# EAGLE schematic 2x16MUX_1 (EAGLE 6.5.0)

## Sheet 1 of 10
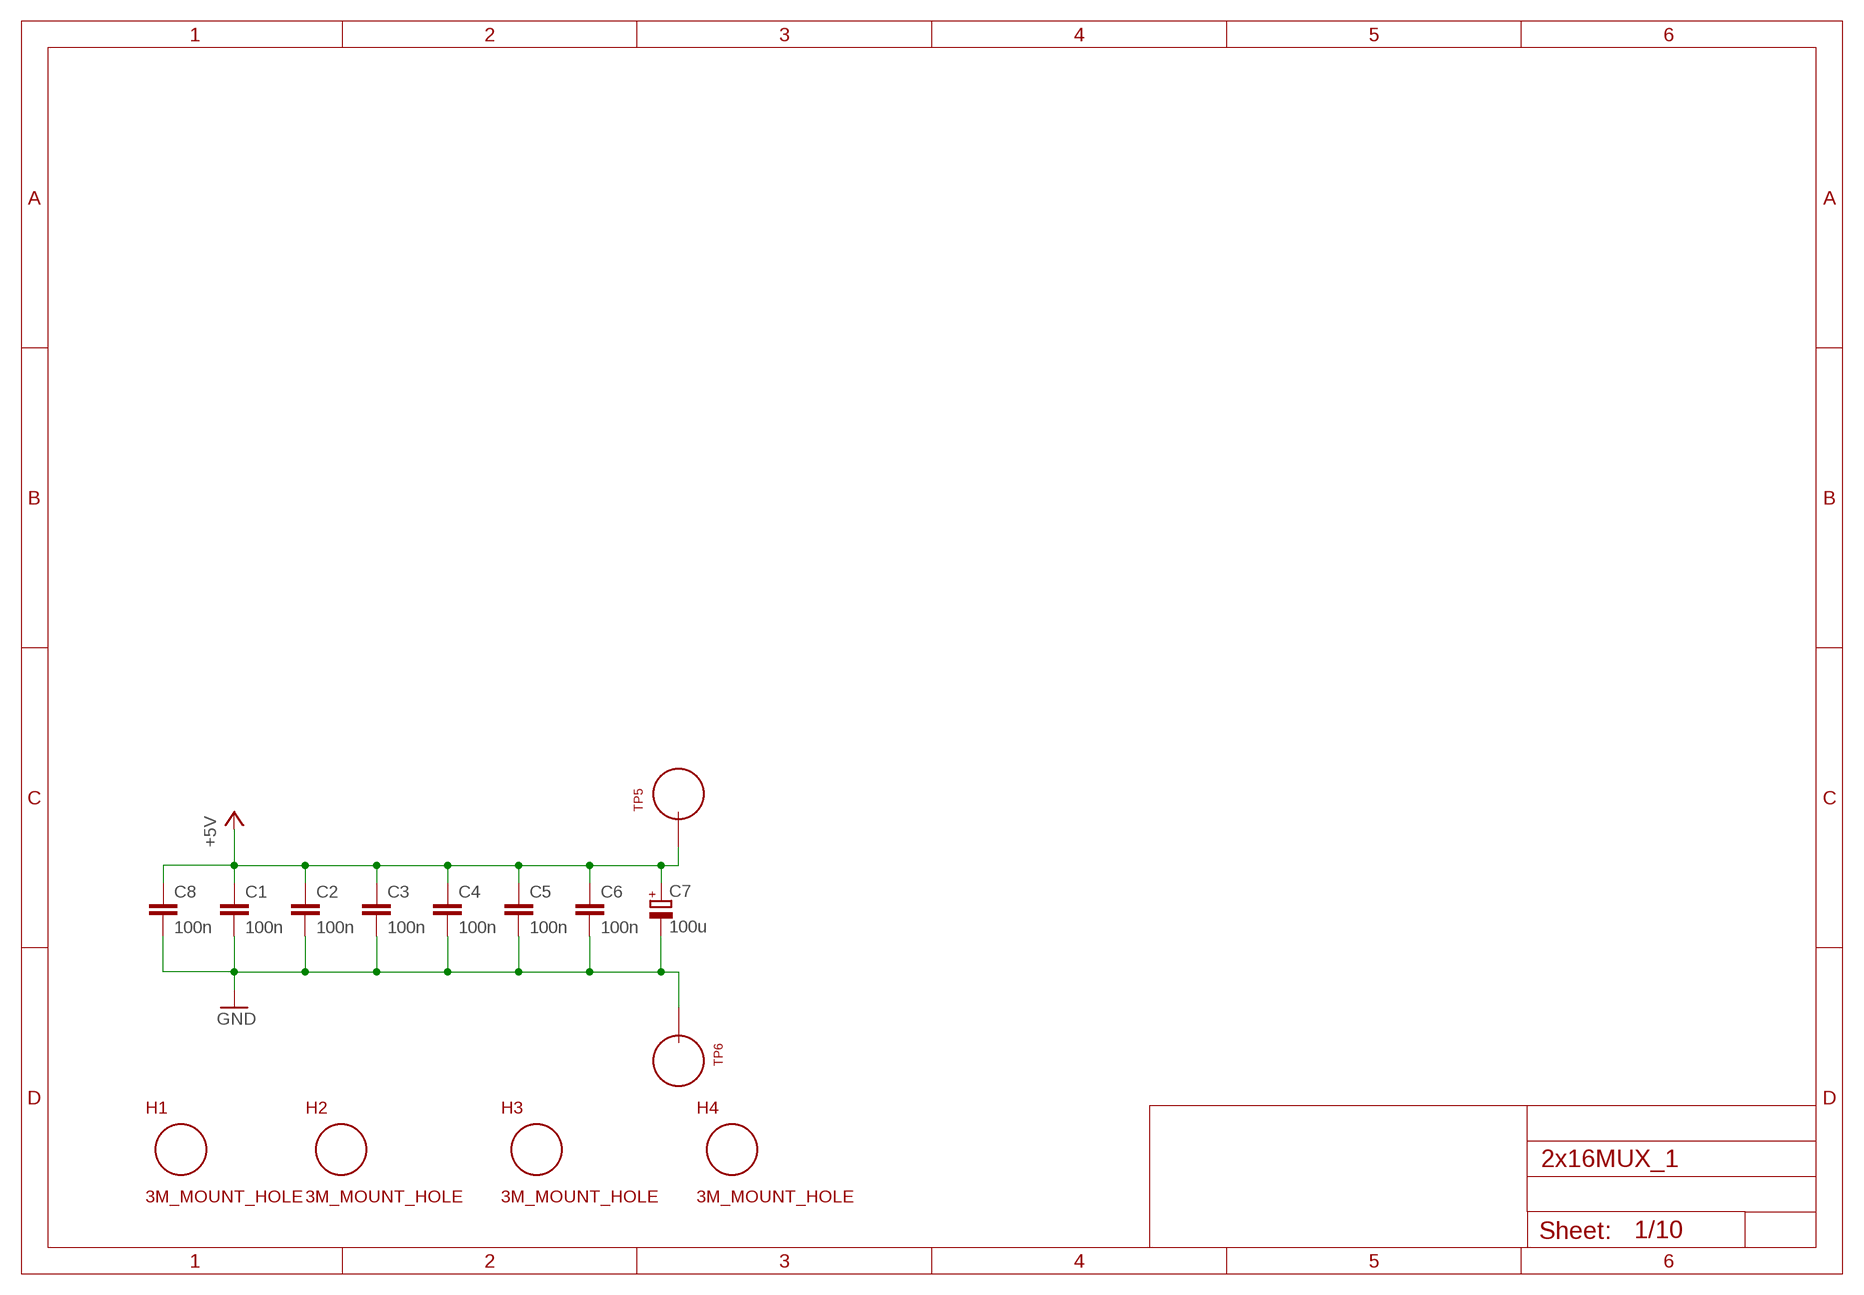
[diagram p0: schematic, sheet 1]

### Parts
C1  100n  C_P2INCH  [CAP_P2INCH]
C2  100n  C_P2INCH  [CAP_P2INCH]
C3  100n  C_P2INCH  [CAP_P2INCH]
C4  100n  C_P2INCH  [CAP_P2INCH]
C5  100n  C_P2INCH  [CAP_P2INCH]
C6  100n  C_P2INCH  [CAP_P2INCH]
C7  100u  POLARISED_CAP_2P5_6P3MM  [POLARISED_CAP_2P5_6P3MM]
C8  100n  C_P2INCH  [CAP_P2INCH]
H1  3M_MOUNT_HOLE  [3M_HOLE]
H2  3M_MOUNT_HOLE  [3M_HOLE]
H3  3M_MOUNT_HOLE  [3M_HOLE]
H4  3M_MOUNT_HOLE  [3M_HOLE]
TP5  TEST_LOOP  [TEST_LOOP]
TP6  TEST_LOOP  [TEST_LOOP]

### Nets
+5V: C1.1 C2.1 C3.1 C4.1 C5.1 C6.1 C7.A C8.1 TP5.P$1 ; also sheet 2,3,4,5,6,7,8,9
GND: C1.2 C2.2 C3.2 C4.2 C5.2 C6.2 C7.K C8.2 TP6.P$1 ; also sheet 2,3,4,5,6,7,8,9,10

## Sheet 2 of 10
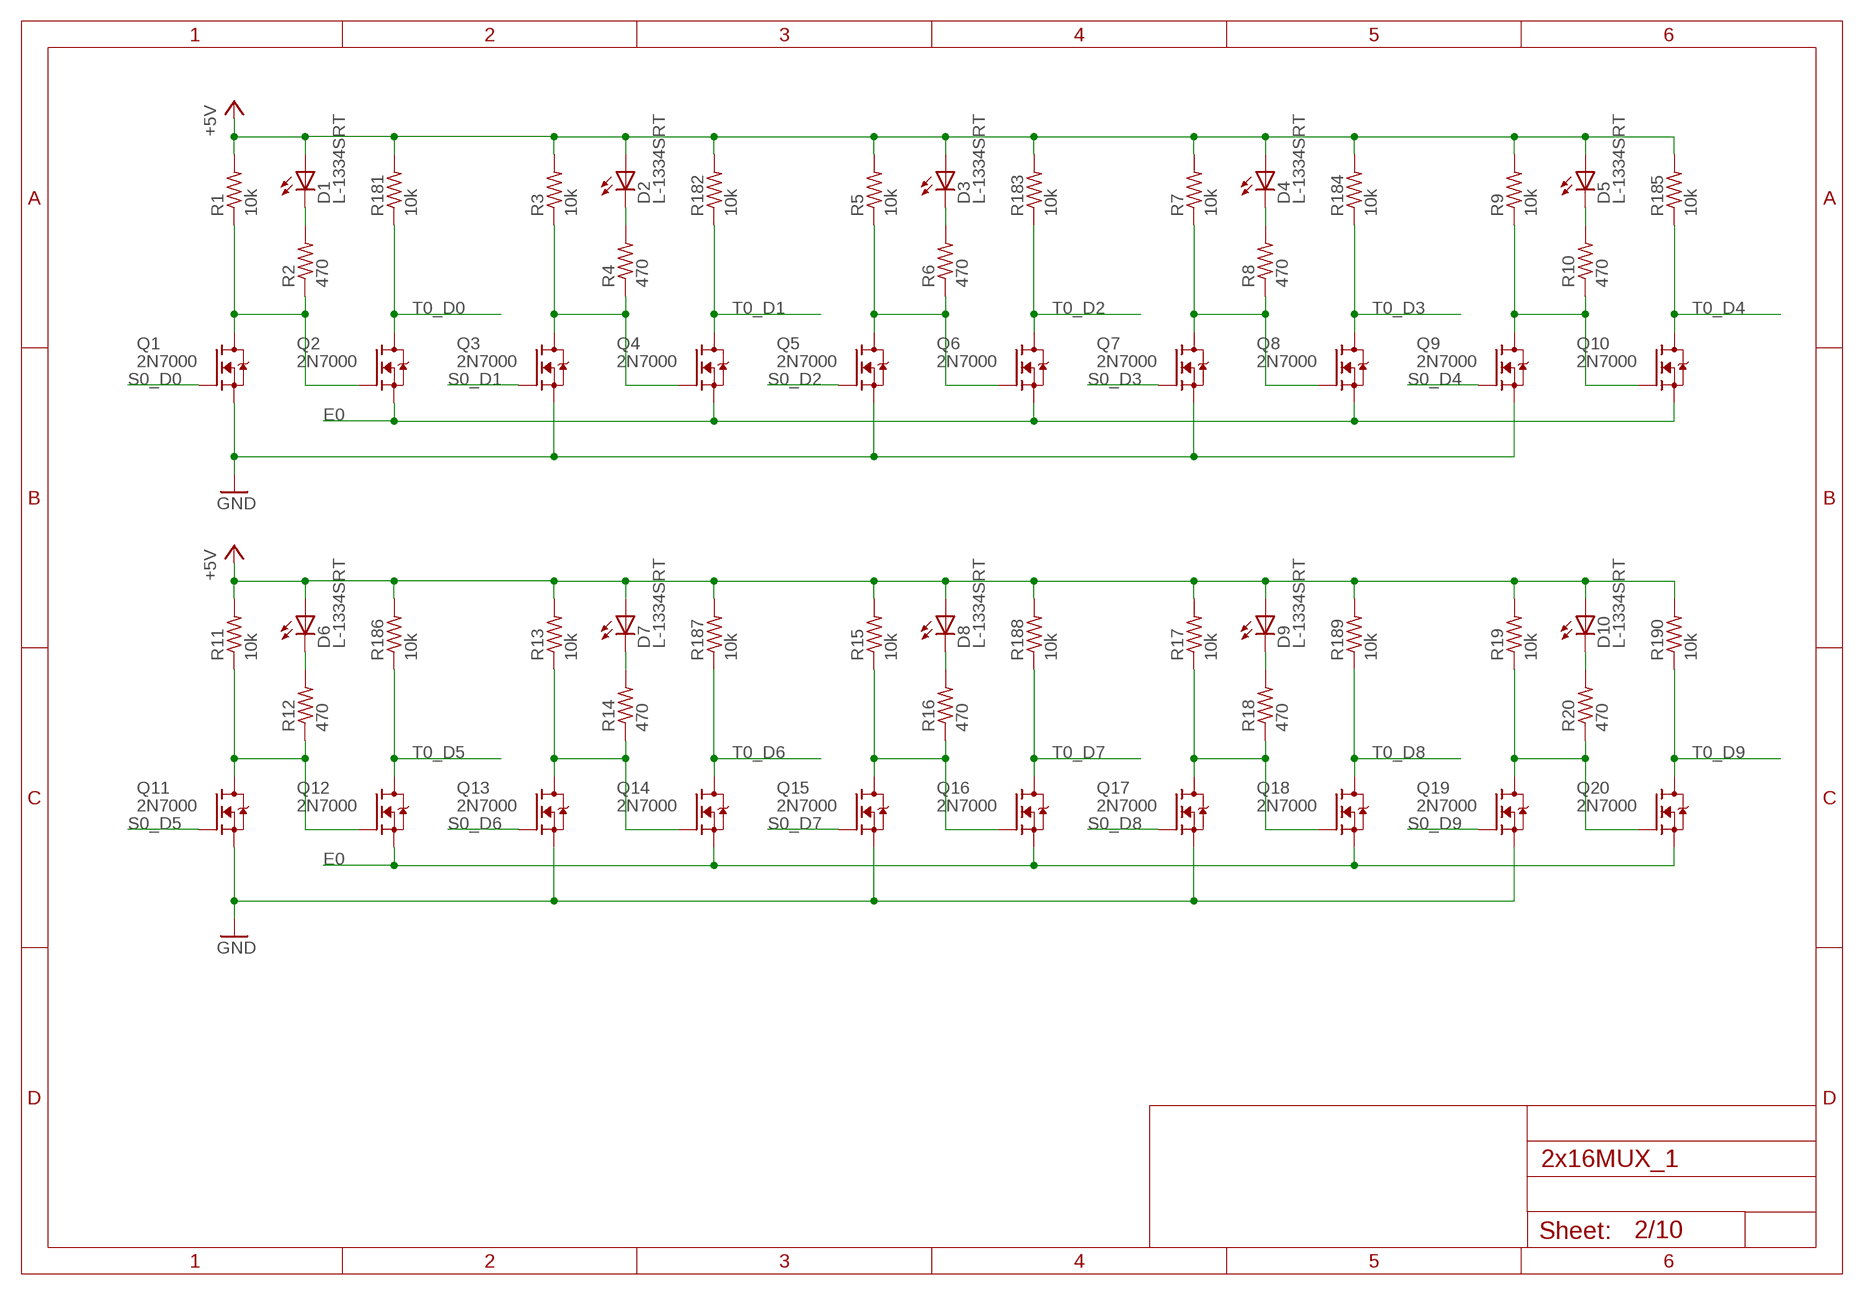
[diagram p1: schematic, sheet 2]

### Parts
D1  L-1334SRT  [LED3MM]
D2  L-1334SRT  [LED3MM]
D3  L-1334SRT  [LED3MM]
D4  L-1334SRT  [LED3MM]
D5  L-1334SRT  [LED3MM]
D6  L-1334SRT  [LED3MM]
D7  L-1334SRT  [LED3MM]
D8  L-1334SRT  [LED3MM]
D9  L-1334SRT  [LED3MM]
D10  L-1334SRT  [LED3MM]
Q1  2N7000  [TO92-DGS]
Q2  2N7000  [TO92-DGS]
Q3  2N7000  [TO92-DGS]
Q4  2N7000  [TO92-DGS]
Q5  2N7000  [TO92-DGS]
Q6  2N7000  [TO92-DGS]
Q7  2N7000  [TO92-DGS]
Q8  2N7000  [TO92-DGS]
Q9  2N7000  [TO92-DGS]
Q10  2N7000  [TO92-DGS]
Q11  2N7000  [TO92-DGS]
Q12  2N7000  [TO92-DGS]
Q13  2N7000  [TO92-DGS]
Q14  2N7000  [TO92-DGS]
Q15  2N7000  [TO92-DGS]
Q16  2N7000  [TO92-DGS]
Q17  2N7000  [TO92-DGS]
Q18  2N7000  [TO92-DGS]
Q19  2N7000  [TO92-DGS]
Q20  2N7000  [TO92-DGS]
R1  10k  R_P2INCH  [R_P2INCH]
R2  470  R_P2INCH  [R_P2INCH]
R3  10k  R_P2INCH  [R_P2INCH]
R4  470  R_P2INCH  [R_P2INCH]
R5  10k  R_P2INCH  [R_P2INCH]
R6  470  R_P2INCH  [R_P2INCH]
R7  10k  R_P2INCH  [R_P2INCH]
R8  470  R_P2INCH  [R_P2INCH]
R9  10k  R_P2INCH  [R_P2INCH]
R10  470  R_P2INCH  [R_P2INCH]
R11  10k  R_P2INCH  [R_P2INCH]
R12  470  R_P2INCH  [R_P2INCH]
R13  10k  R_P2INCH  [R_P2INCH]
R14  470  R_P2INCH  [R_P2INCH]
R15  10k  R_P2INCH  [R_P2INCH]
R16  470  R_P2INCH  [R_P2INCH]
R17  10k  R_P2INCH  [R_P2INCH]
R18  470  R_P2INCH  [R_P2INCH]
R19  10k  R_P2INCH  [R_P2INCH]
R20  470  R_P2INCH  [R_P2INCH]
R181  10k  R_P2INCH  [R_P2INCH]
R182  10k  R_P2INCH  [R_P2INCH]
R183  10k  R_P2INCH  [R_P2INCH]
R184  10k  R_P2INCH  [R_P2INCH]
R185  10k  R_P2INCH  [R_P2INCH]
R186  10k  R_P2INCH  [R_P2INCH]
R187  10k  R_P2INCH  [R_P2INCH]
R188  10k  R_P2INCH  [R_P2INCH]
R189  10k  R_P2INCH  [R_P2INCH]
R190  10k  R_P2INCH  [R_P2INCH]

### Nets
+5V: D1.A D2.A D3.A D4.A D5.A D6.A D7.A D8.A D9.A D10.A R1.2 R3.2 R5.2 R7.2 R9.2 R11.2 R13.2 R15.2 R17.2 R19.2 R181.2 R182.2 R183.2 R184.2 R185.2 R186.2 R187.2 R188.2 R189.2 R190.2 ; also sheet 1,3,4,5,6,7,8,9
E0: Q2.S Q4.S Q6.S Q8.S Q10.S Q12.S Q14.S Q16.S Q18.S Q20.S ; also sheet 3
GND: Q1.S Q3.S Q5.S Q7.S Q9.S Q11.S Q13.S Q15.S Q17.S Q19.S ; also sheet 1,3,4,5,6,7,8,9,10
N$1: Q3.D Q4.G R3.1 R4.1
N$2: Q1.D Q2.G R1.1 R2.1
N$3: D1.K(C) R2.2
N$4: D2.K(C) R4.2
N$5: Q5.D Q6.G R5.1 R6.1
N$6: D3.K(C) R6.2
N$7: Q7.D Q8.G R7.1 R8.1
N$8: D4.K(C) R8.2
N$9: Q9.D Q10.G R9.1 R10.1
N$10: D5.K(C) R10.2
N$12: Q11.D Q12.G R11.1 R12.1
N$13: D6.K(C) R12.2
N$14: Q13.D Q14.G R13.1 R14.1
N$15: D7.K(C) R14.2
N$16: Q15.D Q16.G R15.1 R16.1
N$17: D8.K(C) R16.2
N$18: Q17.D Q18.G R17.1 R18.1
N$19: D9.K(C) R18.2
N$20: Q19.D Q20.G R19.1 R20.1
N$21: D10.K(C) R20.2
S0_D0: Q1.G ; also sheet 3
S0_D1: Q3.G ; also sheet 3
S0_D2: Q5.G ; also sheet 3
S0_D3: Q7.G ; also sheet 3
S0_D4: Q9.G ; also sheet 3
S0_D5: Q11.G ; also sheet 3
S0_D6: Q13.G ; also sheet 3
S0_D7: Q15.G ; also sheet 3
S0_D8: Q17.G ; also sheet 3
S0_D9: Q19.G ; also sheet 3
T0_D0: Q2.D R181.1 ; also sheet 6
T0_D1: Q4.D R182.1 ; also sheet 6
T0_D2: Q6.D R183.1 ; also sheet 6
T0_D3: Q8.D R184.1 ; also sheet 6
T0_D4: Q10.D R185.1 ; also sheet 7
T0_D5: Q12.D R186.1 ; also sheet 7
T0_D6: Q14.D R187.1 ; also sheet 7
T0_D7: Q16.D R188.1 ; also sheet 7
T0_D8: Q18.D R189.1 ; also sheet 8
T0_D9: Q20.D R190.1 ; also sheet 8

## Sheet 3 of 10
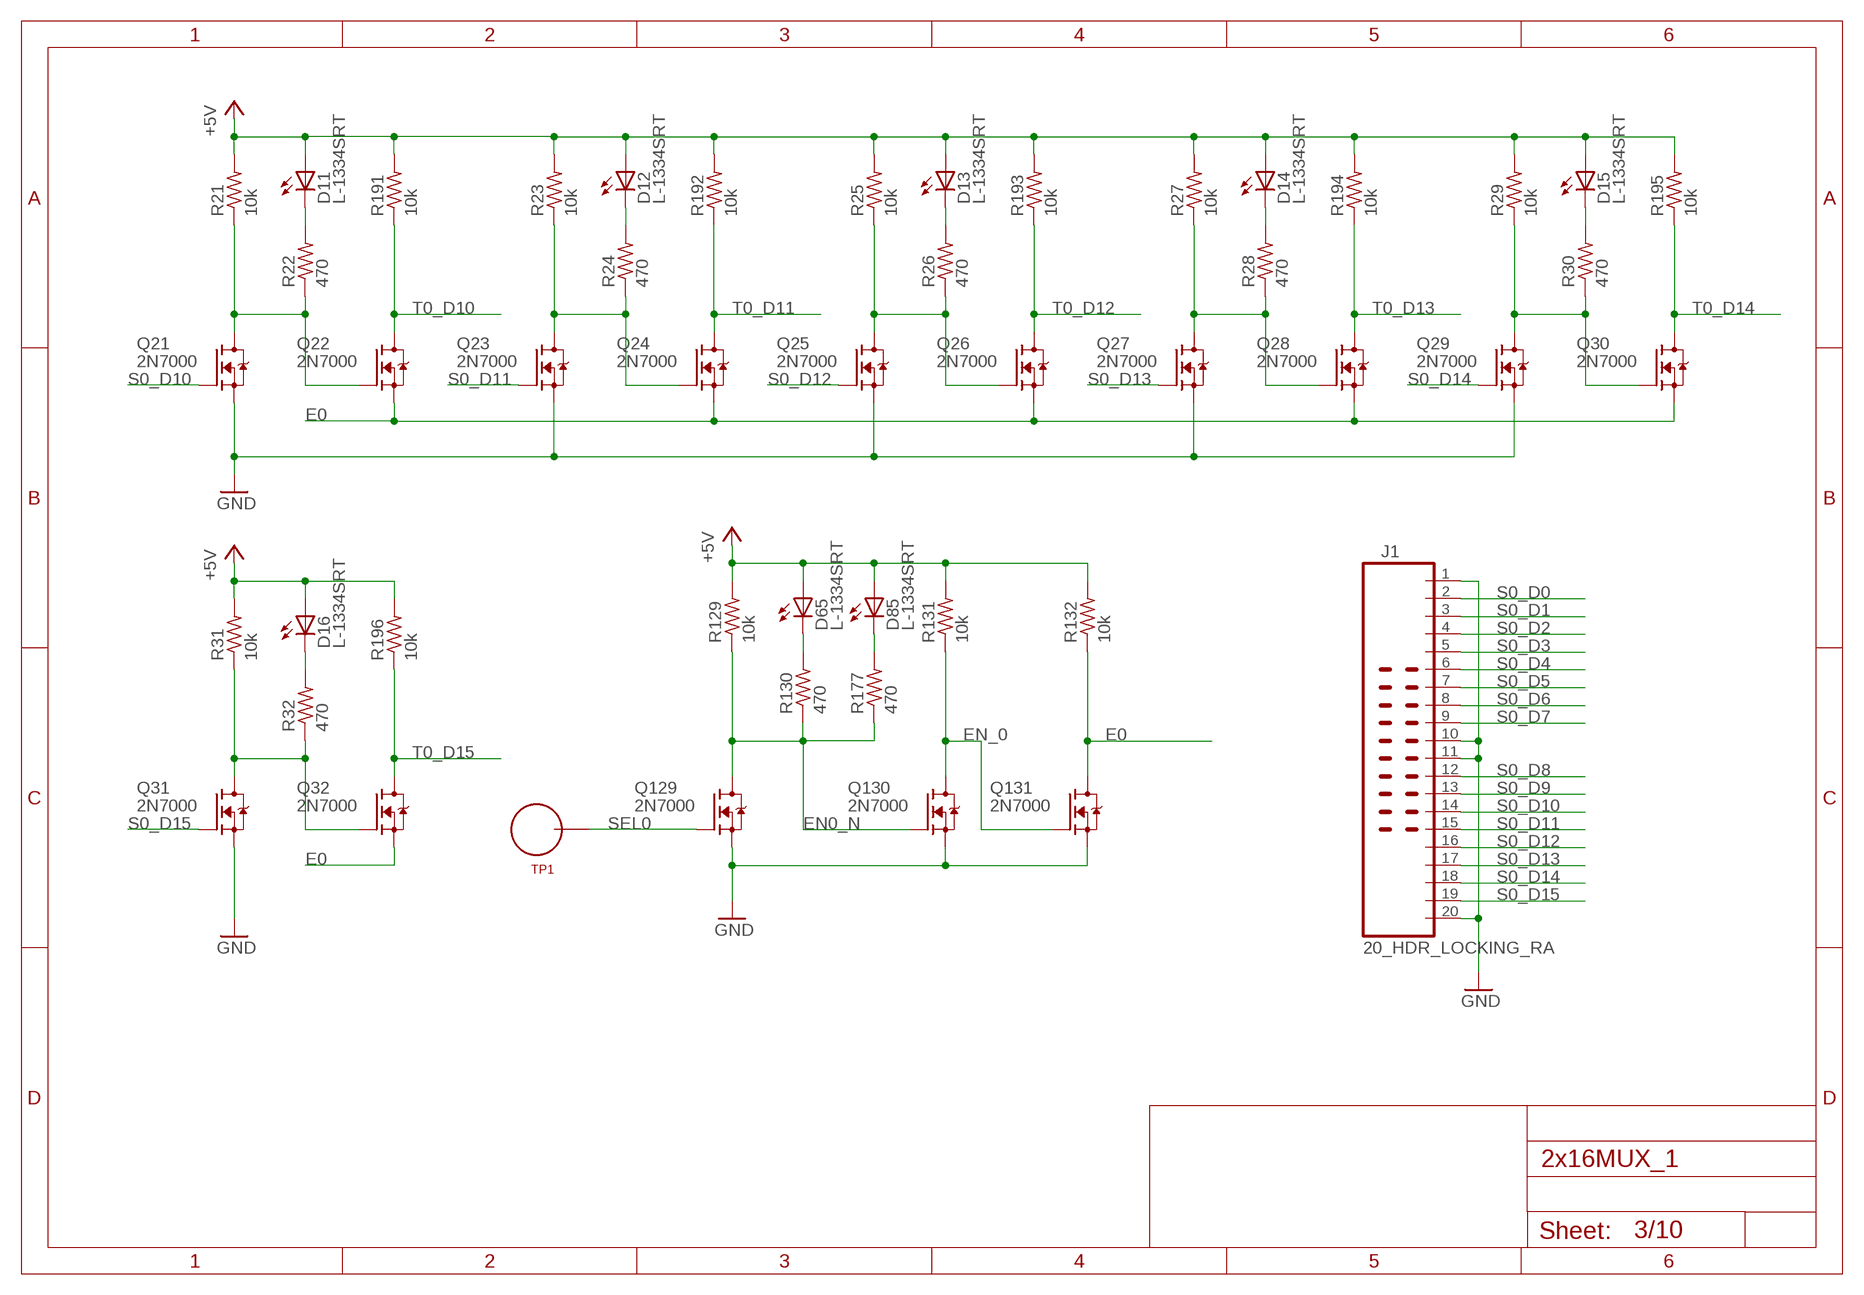
[diagram p2: schematic, sheet 3]

### Parts
D11  L-1334SRT  [LED3MM]
D12  L-1334SRT  [LED3MM]
D13  L-1334SRT  [LED3MM]
D14  L-1334SRT  [LED3MM]
D15  L-1334SRT  [LED3MM]
D16  L-1334SRT  [LED3MM]
D65  L-1334SRT  [LED3MM]
D85  L-1334SRT  [LED3MM]
J1  20_HDR_LOCKING_RA  [20_HDR_LOCKING_RA]
Q21  2N7000  [TO92-DGS]
Q22  2N7000  [TO92-DGS]
Q23  2N7000  [TO92-DGS]
Q24  2N7000  [TO92-DGS]
Q25  2N7000  [TO92-DGS]
Q26  2N7000  [TO92-DGS]
Q27  2N7000  [TO92-DGS]
Q28  2N7000  [TO92-DGS]
Q29  2N7000  [TO92-DGS]
Q30  2N7000  [TO92-DGS]
Q31  2N7000  [TO92-DGS]
Q32  2N7000  [TO92-DGS]
Q129  2N7000  [TO92-DGS]
Q130  2N7000  [TO92-DGS]
Q131  2N7000  [TO92-DGS]
R21  10k  R_P2INCH  [R_P2INCH]
R22  470  R_P2INCH  [R_P2INCH]
R23  10k  R_P2INCH  [R_P2INCH]
R24  470  R_P2INCH  [R_P2INCH]
R25  10k  R_P2INCH  [R_P2INCH]
R26  470  R_P2INCH  [R_P2INCH]
R27  10k  R_P2INCH  [R_P2INCH]
R28  470  R_P2INCH  [R_P2INCH]
R29  10k  R_P2INCH  [R_P2INCH]
R30  470  R_P2INCH  [R_P2INCH]
R31  10k  R_P2INCH  [R_P2INCH]
R32  470  R_P2INCH  [R_P2INCH]
R129  10k  R_P2INCH  [R_P2INCH]
R130  470  R_P2INCH  [R_P2INCH]
R131  10k  R_P2INCH  [R_P2INCH]
R132  10k  R_P2INCH  [R_P2INCH]
R177  470  R_P2INCH  [R_P2INCH]
R191  10k  R_P2INCH  [R_P2INCH]
R192  10k  R_P2INCH  [R_P2INCH]
R193  10k  R_P2INCH  [R_P2INCH]
R194  10k  R_P2INCH  [R_P2INCH]
R195  10k  R_P2INCH  [R_P2INCH]
R196  10k  R_P2INCH  [R_P2INCH]
TP1  TEST_LOOP  [TEST_LOOP]

### Nets
+5V: D11.A D12.A D13.A D14.A D15.A D16.A D65.A D85.A R21.2 R23.2 R25.2 R27.2 R29.2 R31.2 R129.2 R131.2 R132.2 R191.2 R192.2 R193.2 R194.2 R195.2 R196.2 ; also sheet 1,2,4,5,6,7,8,9
E0: Q22.S Q24.S Q26.S Q28.S Q30.S Q32.S Q131.D R132.1 ; also sheet 2
EN0_N: Q129.D Q130.G R129.1 R130.1 R177.1
EN_0: Q130.D Q131.G R131.1
GND: J1.1 J1.10 J1.11 J1.20 Q21.S Q23.S Q25.S Q27.S Q29.S Q31.S Q129.S Q130.S Q131.S ; also sheet 1,2,4,5,6,7,8,9,10
N$23: Q21.D Q22.G R21.1 R22.1
N$24: D11.K(C) R22.2
N$25: Q23.D Q24.G R23.1 R24.1
N$26: D12.K(C) R24.2
N$27: Q25.D Q26.G R25.1 R26.1
N$28: D13.K(C) R26.2
N$29: Q27.D Q28.G R27.1 R28.1
N$30: D14.K(C) R28.2
N$31: Q29.D Q30.G R29.1 R30.1
N$32: D15.K(C) R30.2
N$34: Q31.D Q32.G R31.1 R32.1
N$35: D16.K(C) R32.2
N$130: D65.K(C) R130.2
N$165: D85.K(C) R177.2
S0_D0: J1.2 ; also sheet 2
S0_D1: J1.3 ; also sheet 2
S0_D2: J1.4 ; also sheet 2
S0_D3: J1.5 ; also sheet 2
S0_D4: J1.6 ; also sheet 2
S0_D5: J1.7 ; also sheet 2
S0_D6: J1.8 ; also sheet 2
S0_D7: J1.9 ; also sheet 2
S0_D8: J1.12 ; also sheet 2
S0_D9: J1.13 ; also sheet 2
S0_D10: J1.14 Q21.G
S0_D11: J1.15 Q23.G
S0_D12: J1.16 Q25.G
S0_D13: J1.17 Q27.G
S0_D14: J1.18 Q29.G
S0_D15: J1.19 Q31.G
SEL0: Q129.G TP1.P$1
T0_D10: Q22.D R191.1 ; also sheet 8
T0_D11: Q24.D R192.1 ; also sheet 8
T0_D12: Q26.D R193.1 ; also sheet 9
T0_D13: Q28.D R194.1 ; also sheet 9
T0_D14: Q30.D R195.1 ; also sheet 9
T0_D15: Q32.D R196.1 ; also sheet 9

## Sheet 4 of 10
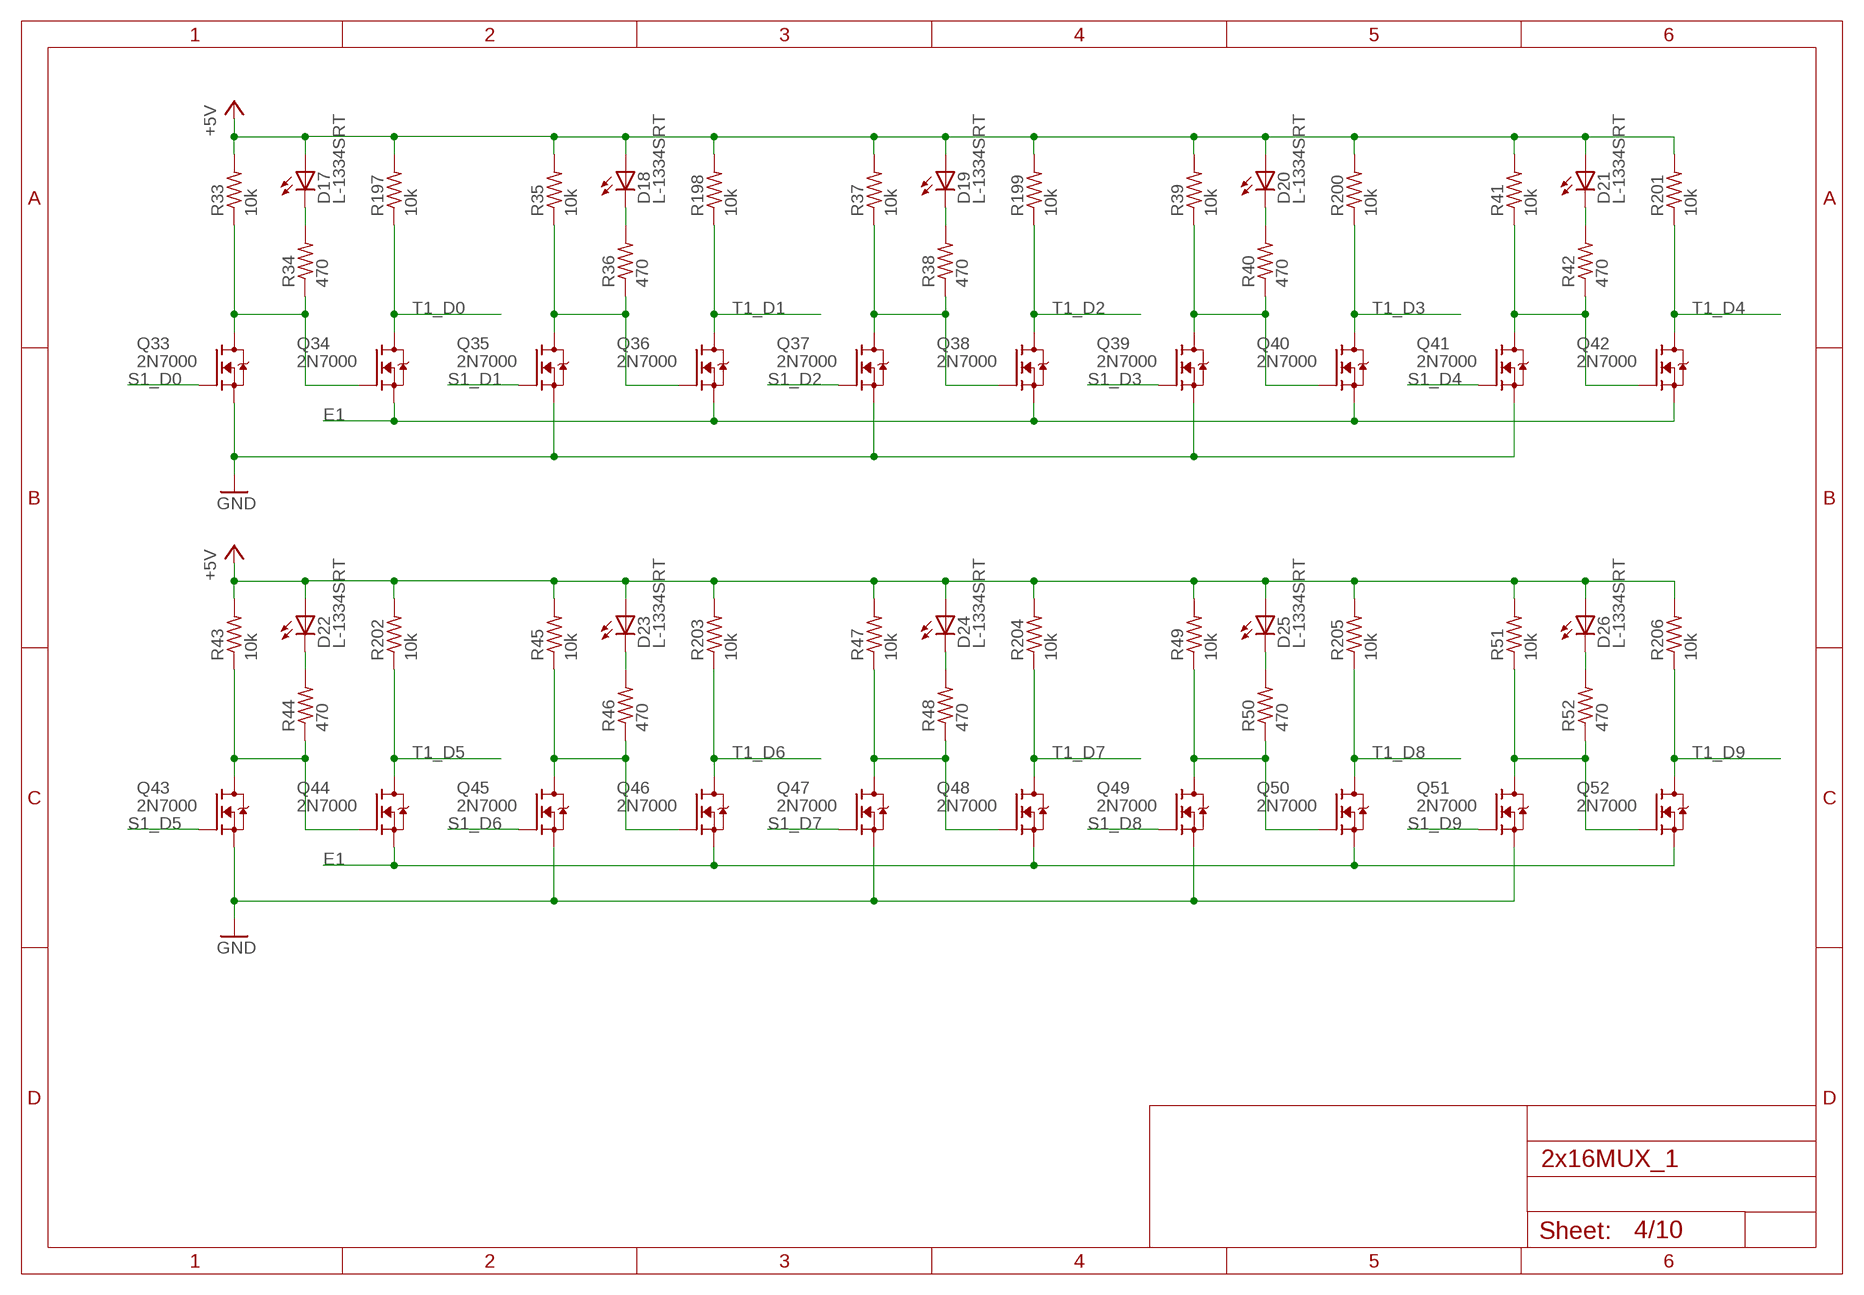
[diagram p3: schematic, sheet 4]

### Parts
D17  L-1334SRT  [LED3MM]
D18  L-1334SRT  [LED3MM]
D19  L-1334SRT  [LED3MM]
D20  L-1334SRT  [LED3MM]
D21  L-1334SRT  [LED3MM]
D22  L-1334SRT  [LED3MM]
D23  L-1334SRT  [LED3MM]
D24  L-1334SRT  [LED3MM]
D25  L-1334SRT  [LED3MM]
D26  L-1334SRT  [LED3MM]
Q33  2N7000  [TO92-DGS]
Q34  2N7000  [TO92-DGS]
Q35  2N7000  [TO92-DGS]
Q36  2N7000  [TO92-DGS]
Q37  2N7000  [TO92-DGS]
Q38  2N7000  [TO92-DGS]
Q39  2N7000  [TO92-DGS]
Q40  2N7000  [TO92-DGS]
Q41  2N7000  [TO92-DGS]
Q42  2N7000  [TO92-DGS]
Q43  2N7000  [TO92-DGS]
Q44  2N7000  [TO92-DGS]
Q45  2N7000  [TO92-DGS]
Q46  2N7000  [TO92-DGS]
Q47  2N7000  [TO92-DGS]
Q48  2N7000  [TO92-DGS]
Q49  2N7000  [TO92-DGS]
Q50  2N7000  [TO92-DGS]
Q51  2N7000  [TO92-DGS]
Q52  2N7000  [TO92-DGS]
R33  10k  R_P2INCH  [R_P2INCH]
R34  470  R_P2INCH  [R_P2INCH]
R35  10k  R_P2INCH  [R_P2INCH]
R36  470  R_P2INCH  [R_P2INCH]
R37  10k  R_P2INCH  [R_P2INCH]
R38  470  R_P2INCH  [R_P2INCH]
R39  10k  R_P2INCH  [R_P2INCH]
R40  470  R_P2INCH  [R_P2INCH]
R41  10k  R_P2INCH  [R_P2INCH]
R42  470  R_P2INCH  [R_P2INCH]
R43  10k  R_P2INCH  [R_P2INCH]
R44  470  R_P2INCH  [R_P2INCH]
R45  10k  R_P2INCH  [R_P2INCH]
R46  470  R_P2INCH  [R_P2INCH]
R47  10k  R_P2INCH  [R_P2INCH]
R48  470  R_P2INCH  [R_P2INCH]
R49  10k  R_P2INCH  [R_P2INCH]
R50  470  R_P2INCH  [R_P2INCH]
R51  10k  R_P2INCH  [R_P2INCH]
R52  470  R_P2INCH  [R_P2INCH]
R197  10k  R_P2INCH  [R_P2INCH]
R198  10k  R_P2INCH  [R_P2INCH]
R199  10k  R_P2INCH  [R_P2INCH]
R200  10k  R_P2INCH  [R_P2INCH]
R201  10k  R_P2INCH  [R_P2INCH]
R202  10k  R_P2INCH  [R_P2INCH]
R203  10k  R_P2INCH  [R_P2INCH]
R204  10k  R_P2INCH  [R_P2INCH]
R205  10k  R_P2INCH  [R_P2INCH]
R206  10k  R_P2INCH  [R_P2INCH]

### Nets
+5V: D17.A D18.A D19.A D20.A D21.A D22.A D23.A D24.A D25.A D26.A R33.2 R35.2 R37.2 R39.2 R41.2 R43.2 R45.2 R47.2 R49.2 R51.2 R197.2 R198.2 R199.2 R200.2 R201.2 R202.2 R203.2 R204.2 R205.2 R206.2 ; also sheet 1,2,3,5,6,7,8,9
E1: Q34.S Q36.S Q38.S Q40.S Q42.S Q44.S Q46.S Q48.S Q50.S Q52.S ; also sheet 5
GND: Q33.S Q35.S Q37.S Q39.S Q41.S Q43.S Q45.S Q47.S Q49.S Q51.S ; also sheet 1,2,3,5,6,7,8,9,10
N$11: Q33.D Q34.G R33.1 R34.1
N$22: D17.K(C) R34.2
N$33: Q35.D Q36.G R35.1 R36.1
N$36: D18.K(C) R36.2
N$37: Q37.D Q38.G R37.1 R38.1
N$38: D19.K(C) R38.2
N$39: Q39.D Q40.G R39.1 R40.1
N$40: D20.K(C) R40.2
N$41: Q41.D Q42.G R41.1 R42.1
N$42: D21.K(C) R42.2
N$43: Q43.D Q44.G R43.1 R44.1
N$44: D22.K(C) R44.2
N$45: Q45.D Q46.G R45.1 R46.1
N$46: D23.K(C) R46.2
N$47: Q47.D Q48.G R47.1 R48.1
N$48: D24.K(C) R48.2
N$49: Q49.D Q50.G R49.1 R50.1
N$50: D25.K(C) R50.2
N$51: Q51.D Q52.G R51.1 R52.1
N$52: D26.K(C) R52.2
S1_D0: Q33.G ; also sheet 5
S1_D1: Q35.G ; also sheet 5
S1_D2: Q37.G ; also sheet 5
S1_D3: Q39.G ; also sheet 5
S1_D4: Q41.G ; also sheet 5
S1_D5: Q43.G ; also sheet 5
S1_D6: Q45.G ; also sheet 5
S1_D7: Q47.G ; also sheet 5
S1_D8: Q49.G ; also sheet 5
S1_D9: Q51.G ; also sheet 5
T1_D0: Q34.D R197.1 ; also sheet 6
T1_D1: Q36.D R198.1 ; also sheet 6
T1_D2: Q38.D R199.1 ; also sheet 6
T1_D3: Q40.D R200.1 ; also sheet 6
T1_D4: Q42.D R201.1 ; also sheet 7
T1_D5: Q44.D R202.1 ; also sheet 7
T1_D6: Q46.D R203.1 ; also sheet 7
T1_D7: Q48.D R204.1 ; also sheet 7
T1_D8: Q50.D R205.1 ; also sheet 8
T1_D9: Q52.D R206.1 ; also sheet 8

## Sheet 5 of 10
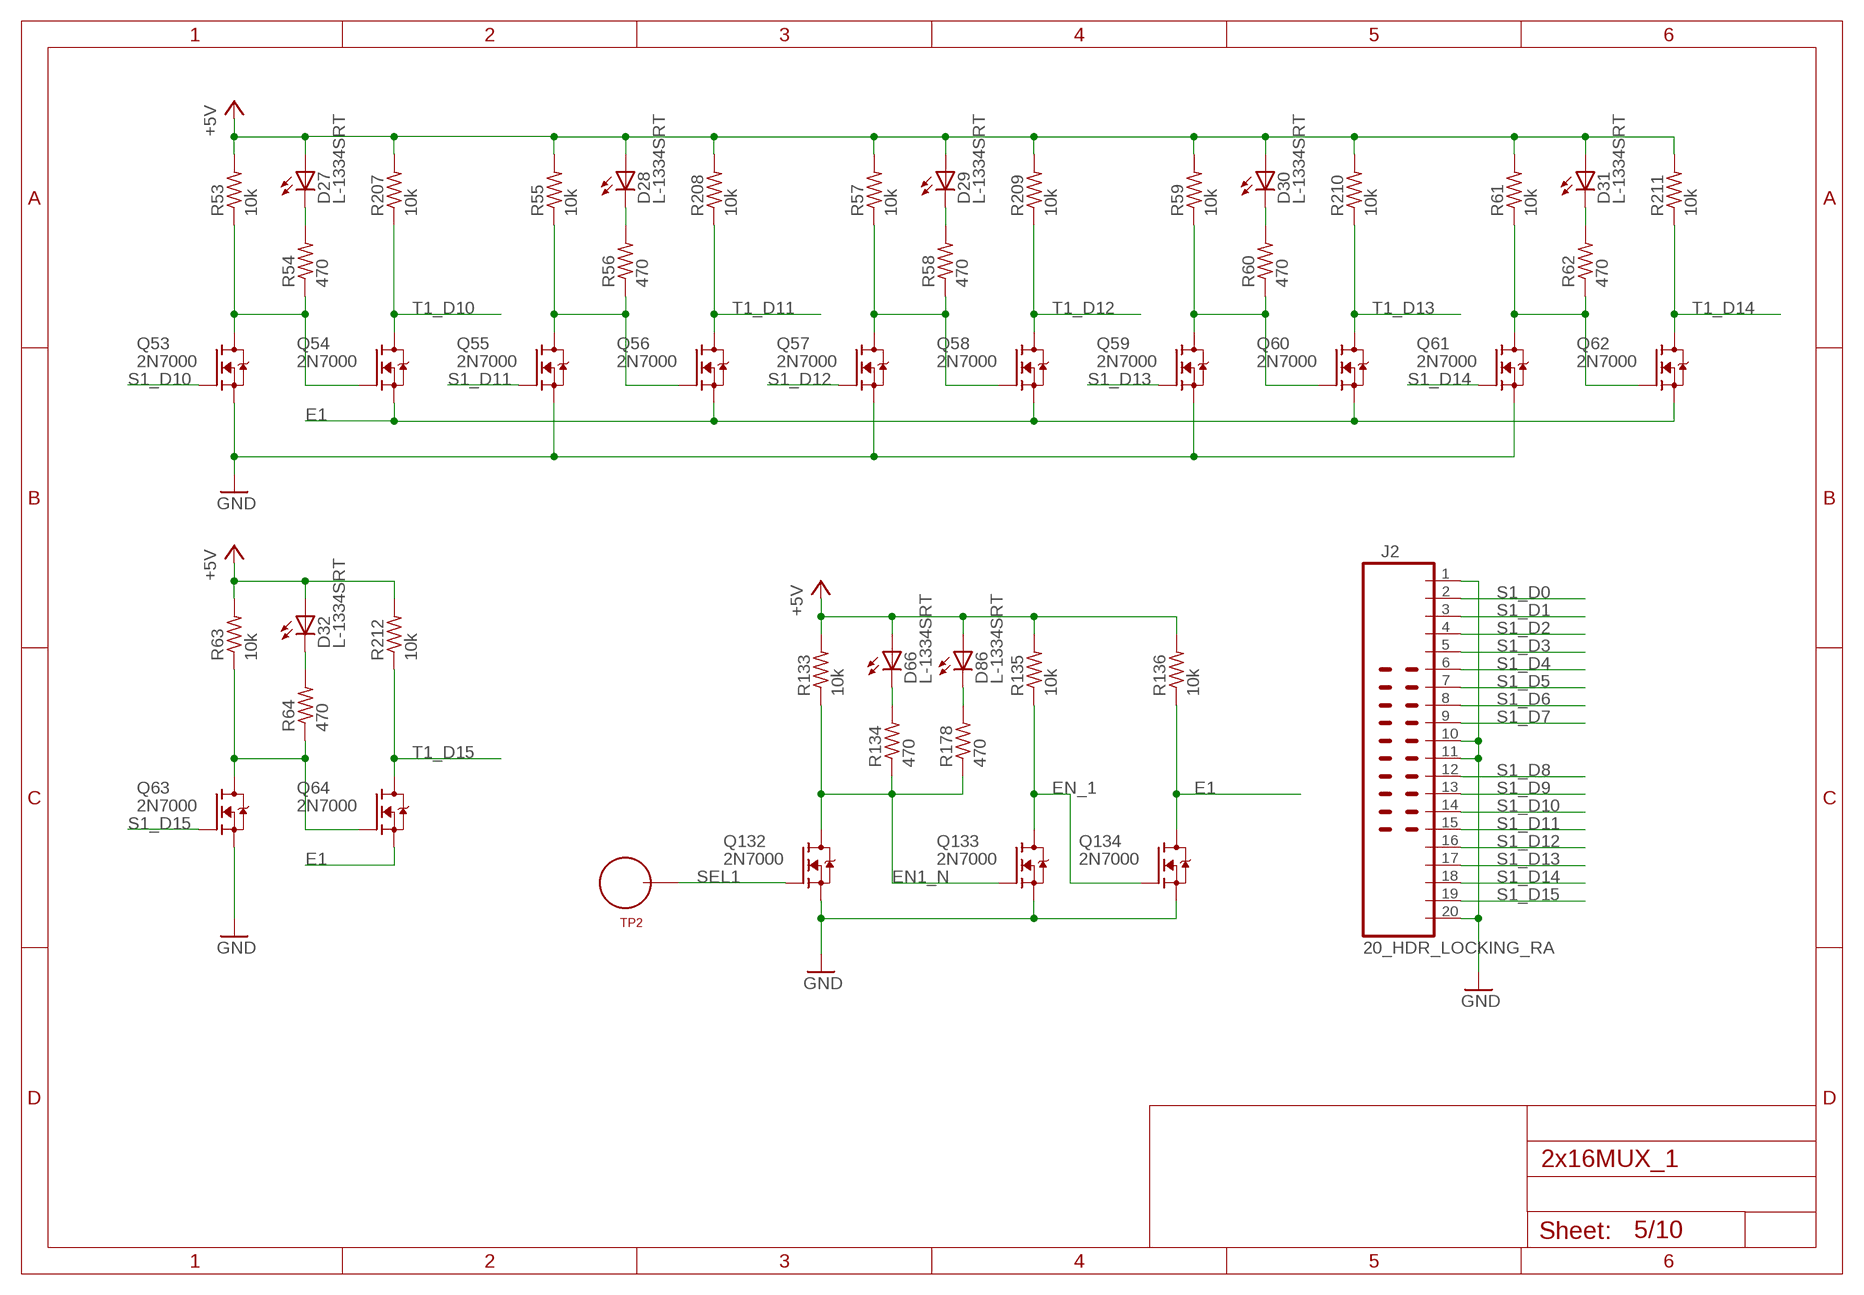
[diagram p4: schematic, sheet 5]

### Parts
D27  L-1334SRT  [LED3MM]
D28  L-1334SRT  [LED3MM]
D29  L-1334SRT  [LED3MM]
D30  L-1334SRT  [LED3MM]
D31  L-1334SRT  [LED3MM]
D32  L-1334SRT  [LED3MM]
D66  L-1334SRT  [LED3MM]
D86  L-1334SRT  [LED3MM]
J2  20_HDR_LOCKING_RA  [20_HDR_LOCKING_RA]
Q53  2N7000  [TO92-DGS]
Q54  2N7000  [TO92-DGS]
Q55  2N7000  [TO92-DGS]
Q56  2N7000  [TO92-DGS]
Q57  2N7000  [TO92-DGS]
Q58  2N7000  [TO92-DGS]
Q59  2N7000  [TO92-DGS]
Q60  2N7000  [TO92-DGS]
Q61  2N7000  [TO92-DGS]
Q62  2N7000  [TO92-DGS]
Q63  2N7000  [TO92-DGS]
Q64  2N7000  [TO92-DGS]
Q132  2N7000  [TO92-DGS]
Q133  2N7000  [TO92-DGS]
Q134  2N7000  [TO92-DGS]
R53  10k  R_P2INCH  [R_P2INCH]
R54  470  R_P2INCH  [R_P2INCH]
R55  10k  R_P2INCH  [R_P2INCH]
R56  470  R_P2INCH  [R_P2INCH]
R57  10k  R_P2INCH  [R_P2INCH]
R58  470  R_P2INCH  [R_P2INCH]
R59  10k  R_P2INCH  [R_P2INCH]
R60  470  R_P2INCH  [R_P2INCH]
R61  10k  R_P2INCH  [R_P2INCH]
R62  470  R_P2INCH  [R_P2INCH]
R63  10k  R_P2INCH  [R_P2INCH]
R64  470  R_P2INCH  [R_P2INCH]
R133  10k  R_P2INCH  [R_P2INCH]
R134  470  R_P2INCH  [R_P2INCH]
R135  10k  R_P2INCH  [R_P2INCH]
R136  10k  R_P2INCH  [R_P2INCH]
R178  470  R_P2INCH  [R_P2INCH]
R207  10k  R_P2INCH  [R_P2INCH]
R208  10k  R_P2INCH  [R_P2INCH]
R209  10k  R_P2INCH  [R_P2INCH]
R210  10k  R_P2INCH  [R_P2INCH]
R211  10k  R_P2INCH  [R_P2INCH]
R212  10k  R_P2INCH  [R_P2INCH]
TP2  TEST_LOOP  [TEST_LOOP]

### Nets
+5V: D27.A D28.A D29.A D30.A D31.A D32.A D66.A D86.A R53.2 R55.2 R57.2 R59.2 R61.2 R63.2 R133.2 R135.2 R136.2 R207.2 R208.2 R209.2 R210.2 R211.2 R212.2 ; also sheet 1,2,3,4,6,7,8,9
E1: Q54.S Q56.S Q58.S Q60.S Q62.S Q64.S Q134.D R136.1 ; also sheet 4
EN1_N: Q132.D Q133.G R133.1 R134.1 R178.1
EN_1: Q133.D Q134.G R135.1
GND: J2.1 J2.10 J2.11 J2.20 Q53.S Q55.S Q57.S Q59.S Q61.S Q63.S Q132.S Q133.S Q134.S ; also sheet 1,2,3,4,6,7,8,9,10
N$53: Q53.D Q54.G R53.1 R54.1
N$54: D27.K(C) R54.2
N$55: Q55.D Q56.G R55.1 R56.1
N$56: D28.K(C) R56.2
N$57: Q57.D Q58.G R57.1 R58.1
N$58: D29.K(C) R58.2
N$59: Q59.D Q60.G R59.1 R60.1
N$60: D30.K(C) R60.2
N$61: Q61.D Q62.G R61.1 R62.1
N$62: D31.K(C) R62.2
N$63: Q63.D Q64.G R63.1 R64.1
N$64: D32.K(C) R64.2
N$129: D66.K(C) R134.2
N$166: D86.K(C) R178.2
S1_D0: J2.2 ; also sheet 4
S1_D1: J2.3 ; also sheet 4
S1_D2: J2.4 ; also sheet 4
S1_D3: J2.5 ; also sheet 4
S1_D4: J2.6 ; also sheet 4
S1_D5: J2.7 ; also sheet 4
S1_D6: J2.8 ; also sheet 4
S1_D7: J2.9 ; also sheet 4
S1_D8: J2.12 ; also sheet 4
S1_D9: J2.13 ; also sheet 4
S1_D10: J2.14 Q53.G
S1_D11: J2.15 Q55.G
S1_D12: J2.16 Q57.G
S1_D13: J2.17 Q59.G
S1_D14: J2.18 Q61.G
S1_D15: J2.19 Q63.G
SEL1: Q132.G TP2.P$1
T1_D10: Q54.D R207.1 ; also sheet 8
T1_D11: Q56.D R208.1 ; also sheet 8
T1_D12: Q58.D R209.1 ; also sheet 9
T1_D13: Q60.D R210.1 ; also sheet 9
T1_D14: Q62.D R211.1 ; also sheet 9
T1_D15: Q64.D R212.1 ; also sheet 9

## Sheet 6 of 10
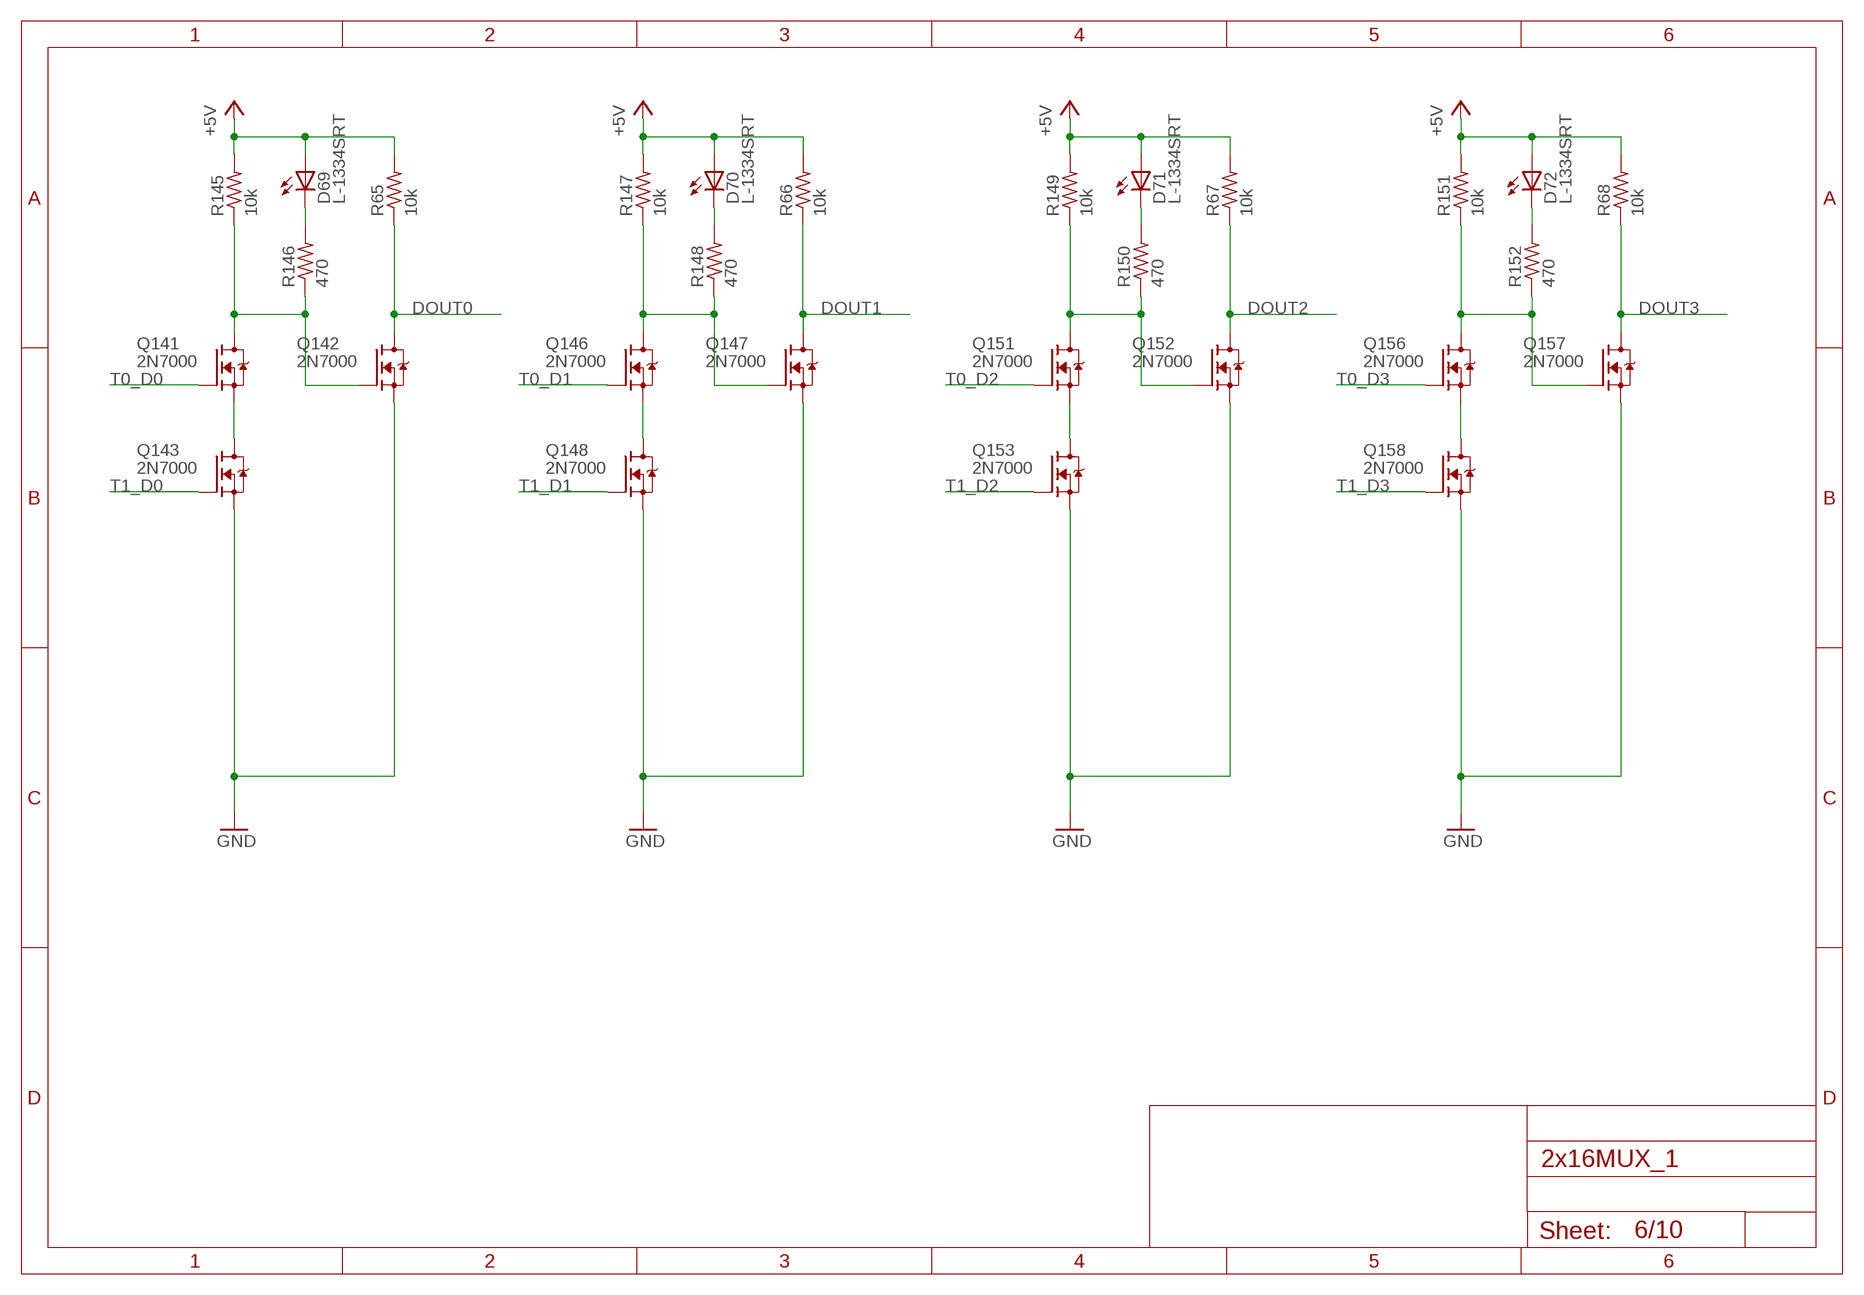
[diagram p5: schematic, sheet 6]

### Parts
D69  L-1334SRT  [LED3MM]
D70  L-1334SRT  [LED3MM]
D71  L-1334SRT  [LED3MM]
D72  L-1334SRT  [LED3MM]
Q141  2N7000  [TO92-DGS]
Q142  2N7000  [TO92-DGS]
Q143  2N7000  [TO92-DGS]
Q146  2N7000  [TO92-DGS]
Q147  2N7000  [TO92-DGS]
Q148  2N7000  [TO92-DGS]
Q151  2N7000  [TO92-DGS]
Q152  2N7000  [TO92-DGS]
Q153  2N7000  [TO92-DGS]
Q156  2N7000  [TO92-DGS]
Q157  2N7000  [TO92-DGS]
Q158  2N7000  [TO92-DGS]
R65  10k  R_P2INCH  [R_P2INCH]
R66  10k  R_P2INCH  [R_P2INCH]
R67  10k  R_P2INCH  [R_P2INCH]
R68  10k  R_P2INCH  [R_P2INCH]
R145  10k  R_P2INCH  [R_P2INCH]
R146  470  R_P2INCH  [R_P2INCH]
R147  10k  R_P2INCH  [R_P2INCH]
R148  470  R_P2INCH  [R_P2INCH]
R149  10k  R_P2INCH  [R_P2INCH]
R150  470  R_P2INCH  [R_P2INCH]
R151  10k  R_P2INCH  [R_P2INCH]
R152  470  R_P2INCH  [R_P2INCH]

### Nets
+5V: D69.A D70.A D71.A D72.A R65.2 R66.2 R67.2 R68.2 R145.2 R147.2 R149.2 R151.2 ; also sheet 1,2,3,4,5,7,8,9
DOUT0: Q142.D R65.1 ; also sheet 10
DOUT1: Q147.D R66.1 ; also sheet 10
DOUT2: Q152.D R67.1 ; also sheet 10
DOUT3: Q157.D R68.1 ; also sheet 10
GND: Q142.S Q143.S Q147.S Q148.S Q152.S Q153.S Q157.S Q158.S ; also sheet 1,2,3,4,5,7,8,9,10
N$133: Q141.D Q142.G R145.1 R146.1
N$134: D69.K(C) R146.2
N$137: Q141.S Q143.D
N$138: Q146.D Q147.G R147.1 R148.1
N$139: D70.K(C) R148.2
N$142: Q146.S Q148.D
N$143: Q151.D Q152.G R149.1 R150.1
N$144: D71.K(C) R150.2
N$147: Q151.S Q153.D
N$148: Q156.D Q157.G R151.1 R152.1
N$149: D72.K(C) R152.2
N$152: Q156.S Q158.D
T0_D0: Q141.G ; also sheet 2
T0_D1: Q146.G ; also sheet 2
T0_D2: Q151.G ; also sheet 2
T0_D3: Q156.G ; also sheet 2
T1_D0: Q143.G ; also sheet 4
T1_D1: Q148.G ; also sheet 4
T1_D2: Q153.G ; also sheet 4
T1_D3: Q158.G ; also sheet 4

## Sheet 7 of 10
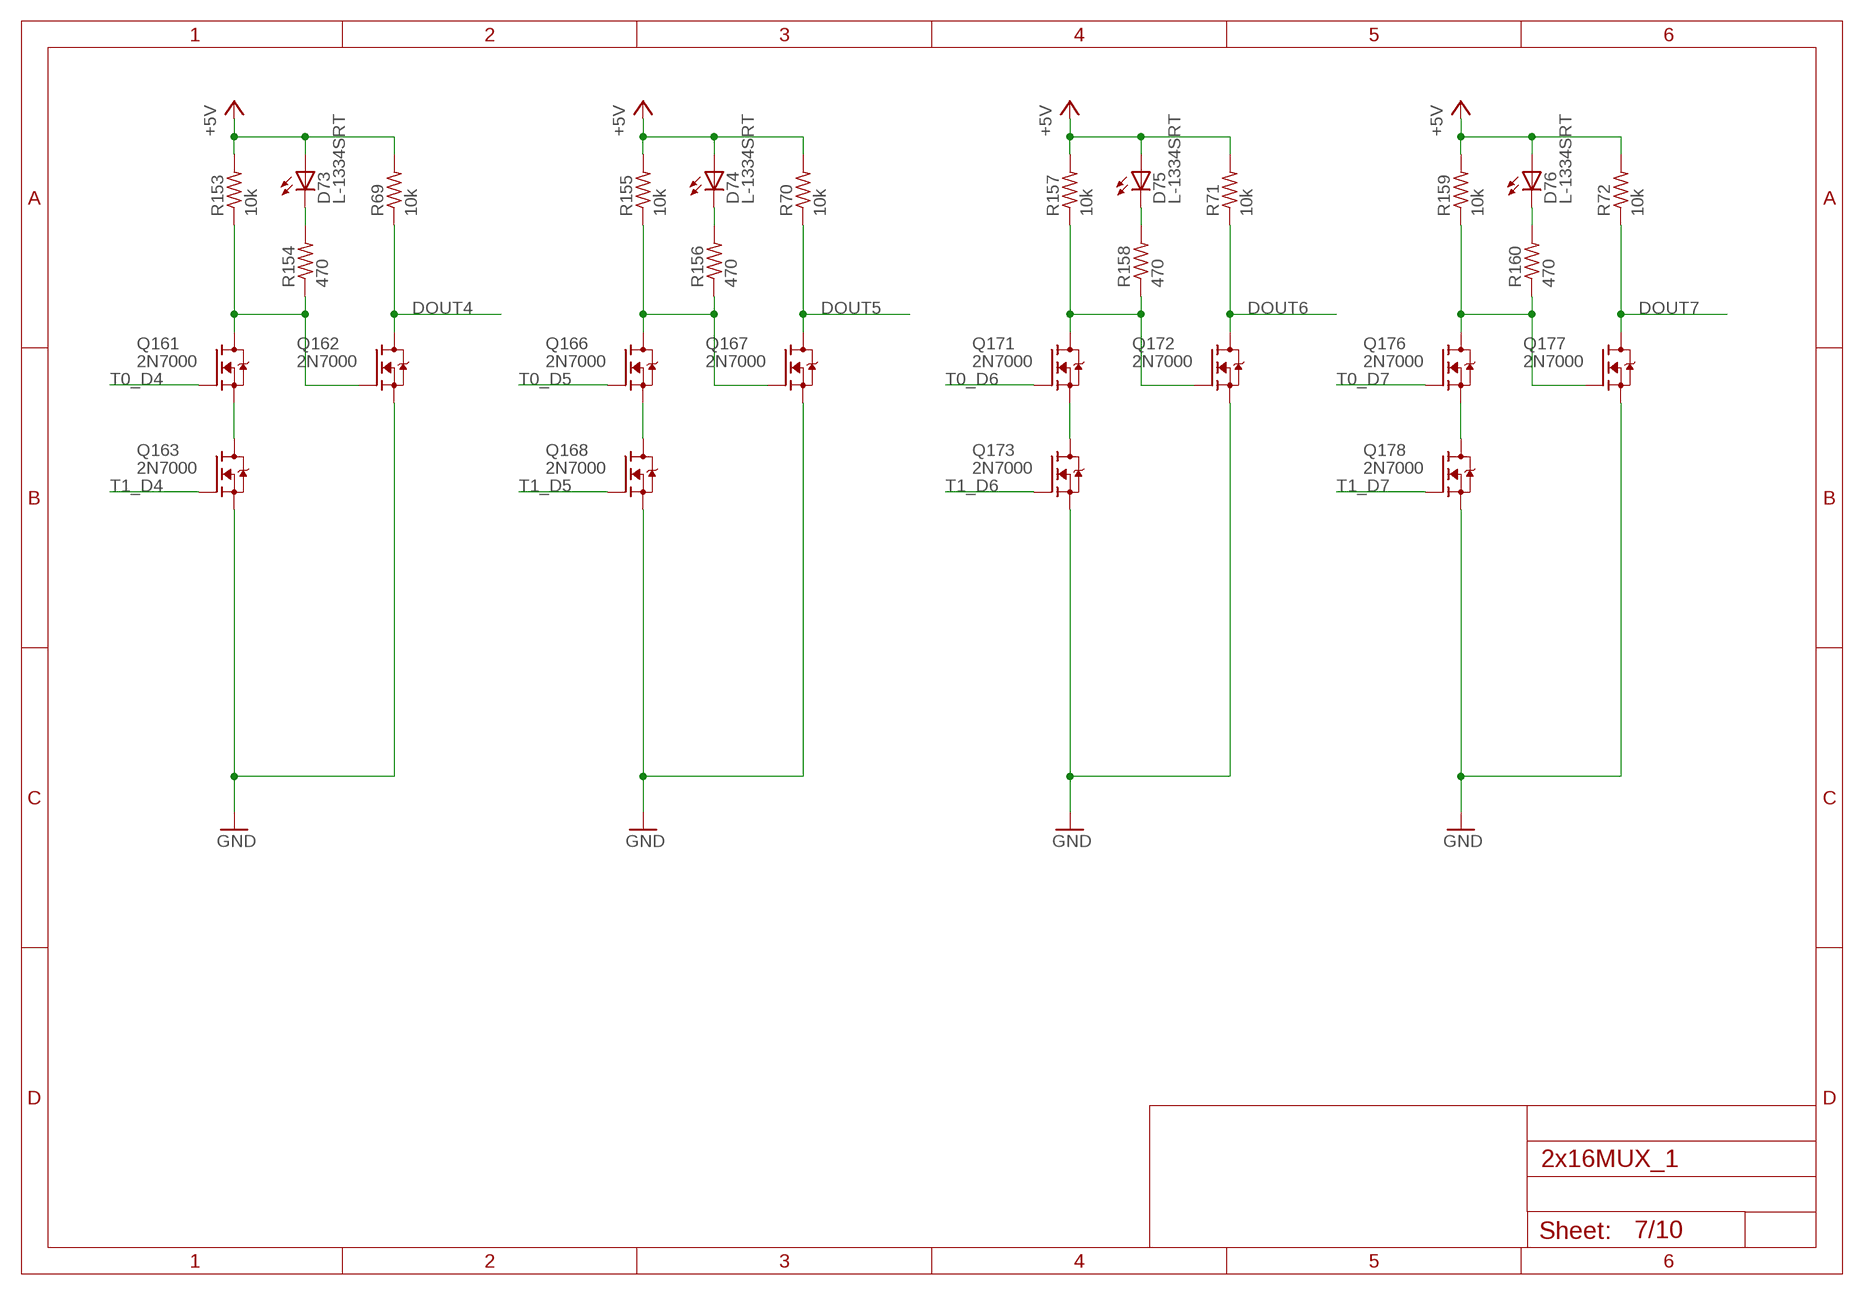
[diagram p6: schematic, sheet 7]

### Parts
D73  L-1334SRT  [LED3MM]
D74  L-1334SRT  [LED3MM]
D75  L-1334SRT  [LED3MM]
D76  L-1334SRT  [LED3MM]
Q161  2N7000  [TO92-DGS]
Q162  2N7000  [TO92-DGS]
Q163  2N7000  [TO92-DGS]
Q166  2N7000  [TO92-DGS]
Q167  2N7000  [TO92-DGS]
Q168  2N7000  [TO92-DGS]
Q171  2N7000  [TO92-DGS]
Q172  2N7000  [TO92-DGS]
Q173  2N7000  [TO92-DGS]
Q176  2N7000  [TO92-DGS]
Q177  2N7000  [TO92-DGS]
Q178  2N7000  [TO92-DGS]
R69  10k  R_P2INCH  [R_P2INCH]
R70  10k  R_P2INCH  [R_P2INCH]
R71  10k  R_P2INCH  [R_P2INCH]
R72  10k  R_P2INCH  [R_P2INCH]
R153  10k  R_P2INCH  [R_P2INCH]
R154  470  R_P2INCH  [R_P2INCH]
R155  10k  R_P2INCH  [R_P2INCH]
R156  470  R_P2INCH  [R_P2INCH]
R157  10k  R_P2INCH  [R_P2INCH]
R158  470  R_P2INCH  [R_P2INCH]
R159  10k  R_P2INCH  [R_P2INCH]
R160  470  R_P2INCH  [R_P2INCH]

### Nets
+5V: D73.A D74.A D75.A D76.A R69.2 R70.2 R71.2 R72.2 R153.2 R155.2 R157.2 R159.2 ; also sheet 1,2,3,4,5,6,8,9
DOUT4: Q162.D R69.1 ; also sheet 10
DOUT5: Q167.D R70.1 ; also sheet 10
DOUT6: Q172.D R71.1 ; also sheet 10
DOUT7: Q177.D R72.1 ; also sheet 10
GND: Q162.S Q163.S Q167.S Q168.S Q172.S Q173.S Q177.S Q178.S ; also sheet 1,2,3,4,5,6,8,9,10
N$153: Q161.D Q162.G R153.1 R154.1
N$154: D73.K(C) R154.2
N$157: Q161.S Q163.D
N$158: Q166.D Q167.G R155.1 R156.1
N$159: D74.K(C) R156.2
N$162: Q166.S Q168.D
N$163: Q171.D Q172.G R157.1 R158.1
N$164: D75.K(C) R158.2
N$171: Q171.S Q173.D
N$172: Q176.D Q177.G R159.1 R160.1
N$173: D76.K(C) R160.2
N$176: Q176.S Q178.D
T0_D4: Q161.G ; also sheet 2
T0_D5: Q166.G ; also sheet 2
T0_D6: Q171.G ; also sheet 2
T0_D7: Q176.G ; also sheet 2
T1_D4: Q163.G ; also sheet 4
T1_D5: Q168.G ; also sheet 4
T1_D6: Q173.G ; also sheet 4
T1_D7: Q178.G ; also sheet 4

## Sheet 8 of 10
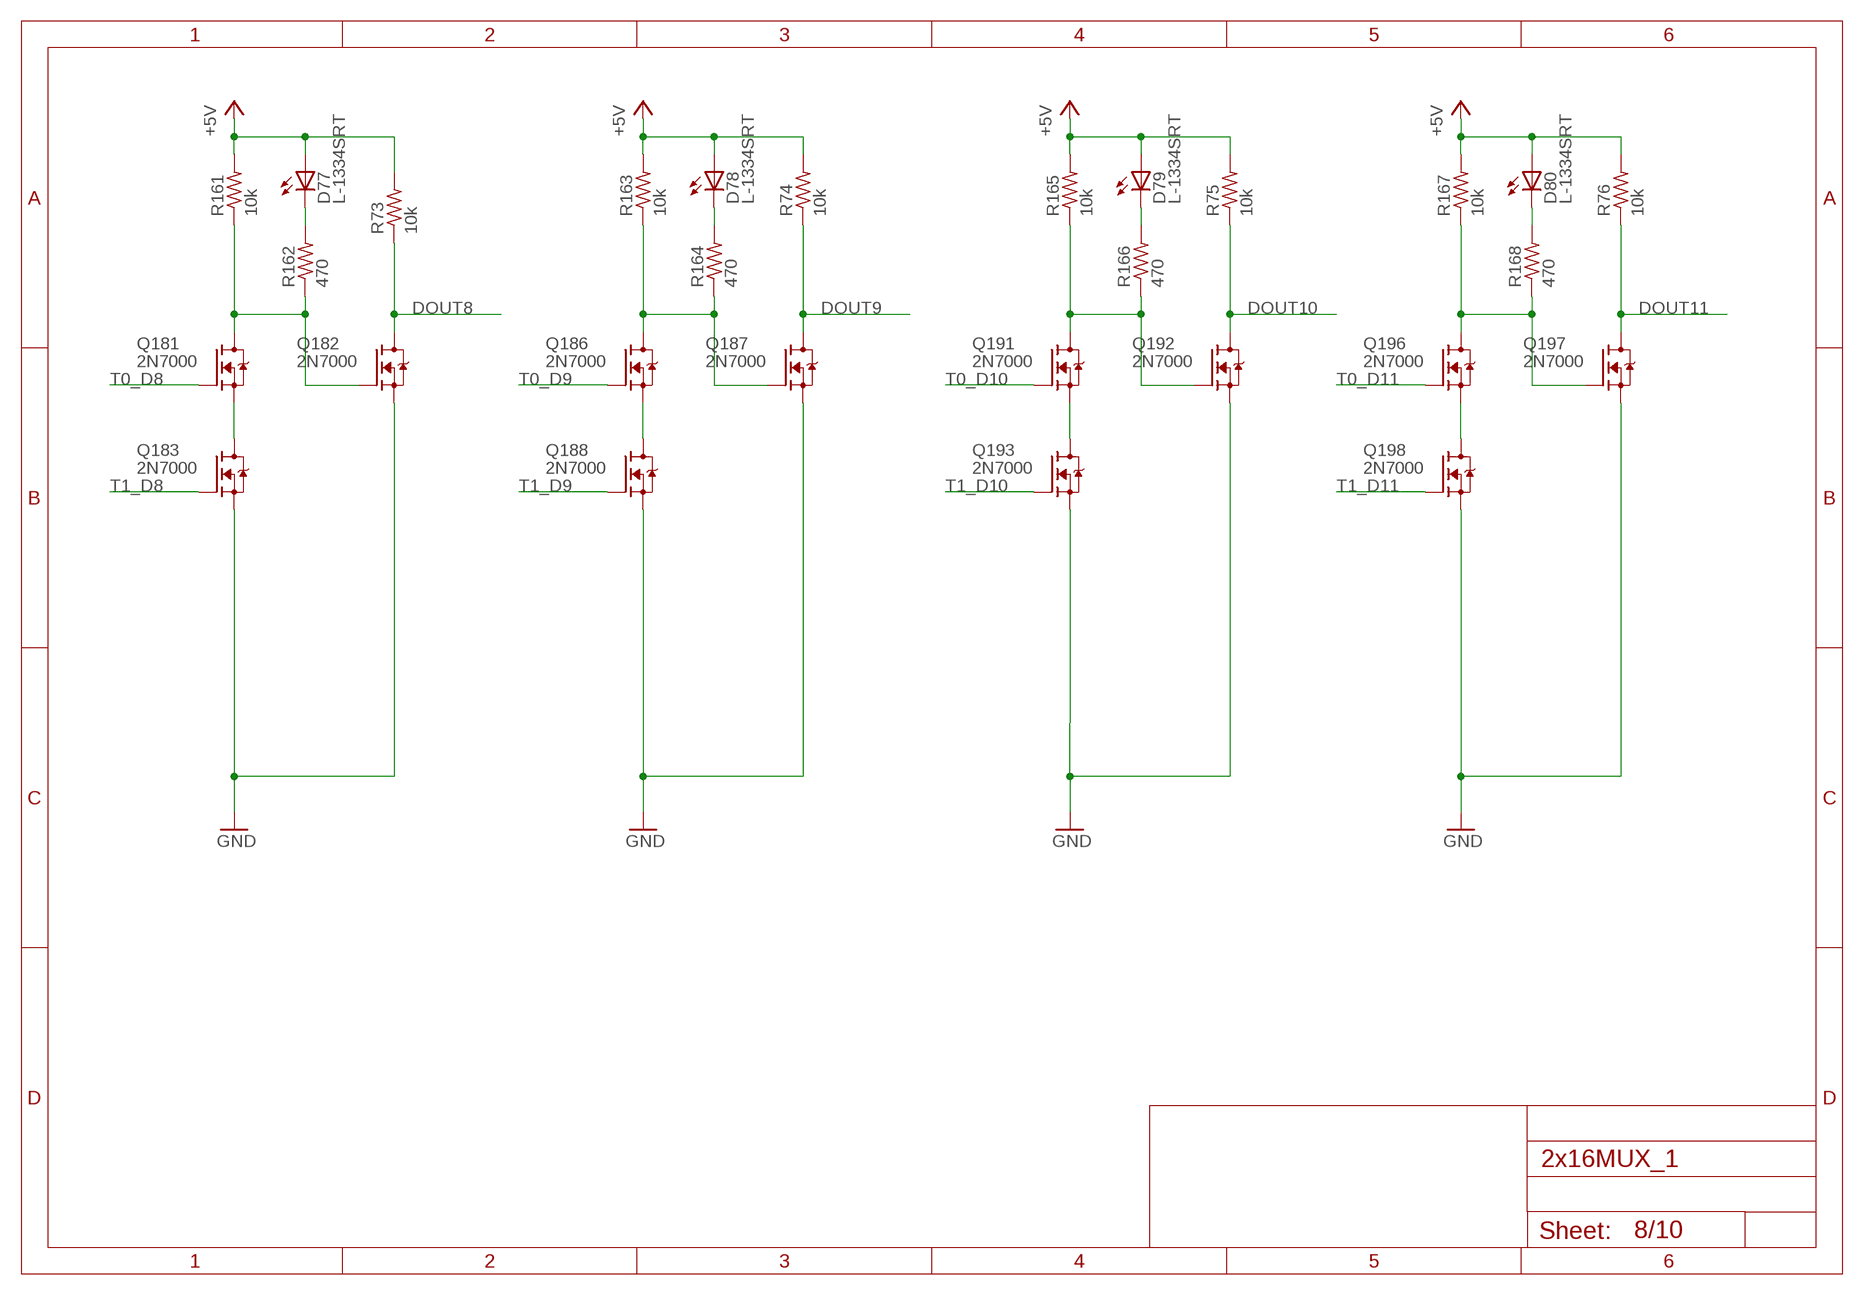
[diagram p7: schematic, sheet 8]

### Parts
D77  L-1334SRT  [LED3MM]
D78  L-1334SRT  [LED3MM]
D79  L-1334SRT  [LED3MM]
D80  L-1334SRT  [LED3MM]
Q181  2N7000  [TO92-DGS]
Q182  2N7000  [TO92-DGS]
Q183  2N7000  [TO92-DGS]
Q186  2N7000  [TO92-DGS]
Q187  2N7000  [TO92-DGS]
Q188  2N7000  [TO92-DGS]
Q191  2N7000  [TO92-DGS]
Q192  2N7000  [TO92-DGS]
Q193  2N7000  [TO92-DGS]
Q196  2N7000  [TO92-DGS]
Q197  2N7000  [TO92-DGS]
Q198  2N7000  [TO92-DGS]
R73  10k  R_P2INCH  [R_P2INCH]
R74  10k  R_P2INCH  [R_P2INCH]
R75  10k  R_P2INCH  [R_P2INCH]
R76  10k  R_P2INCH  [R_P2INCH]
R161  10k  R_P2INCH  [R_P2INCH]
R162  470  R_P2INCH  [R_P2INCH]
R163  10k  R_P2INCH  [R_P2INCH]
R164  470  R_P2INCH  [R_P2INCH]
R165  10k  R_P2INCH  [R_P2INCH]
R166  470  R_P2INCH  [R_P2INCH]
R167  10k  R_P2INCH  [R_P2INCH]
R168  470  R_P2INCH  [R_P2INCH]

### Nets
+5V: D77.A D78.A D79.A D80.A R73.2 R74.2 R75.2 R76.2 R161.2 R163.2 R165.2 R167.2 ; also sheet 1,2,3,4,5,6,7,9
DOUT8: Q182.D R73.1 ; also sheet 10
DOUT9: Q187.D R74.1 ; also sheet 10
DOUT10: Q192.D R75.1 ; also sheet 10
DOUT11: Q197.D R76.1 ; also sheet 10
GND: Q182.S Q183.S Q187.S Q188.S Q192.S Q193.S Q197.S Q198.S ; also sheet 1,2,3,4,5,6,7,9,10
N$177: Q181.D Q182.G R161.1 R162.1
N$178: D77.K(C) R162.2
N$181: Q181.S Q183.D
N$182: Q186.D Q187.G R163.1 R164.1
N$183: D78.K(C) R164.2
N$186: Q186.S Q188.D
N$187: Q191.D Q192.G R165.1 R166.1
N$188: D79.K(C) R166.2
N$191: Q191.S Q193.D
N$192: Q196.D Q197.G R167.1 R168.1
N$193: D80.K(C) R168.2
N$196: Q196.S Q198.D
T0_D8: Q181.G ; also sheet 2
T0_D9: Q186.G ; also sheet 2
T0_D10: Q191.G ; also sheet 3
T0_D11: Q196.G ; also sheet 3
T1_D8: Q183.G ; also sheet 4
T1_D9: Q188.G ; also sheet 4
T1_D10: Q193.G ; also sheet 5
T1_D11: Q198.G ; also sheet 5

## Sheet 9 of 10
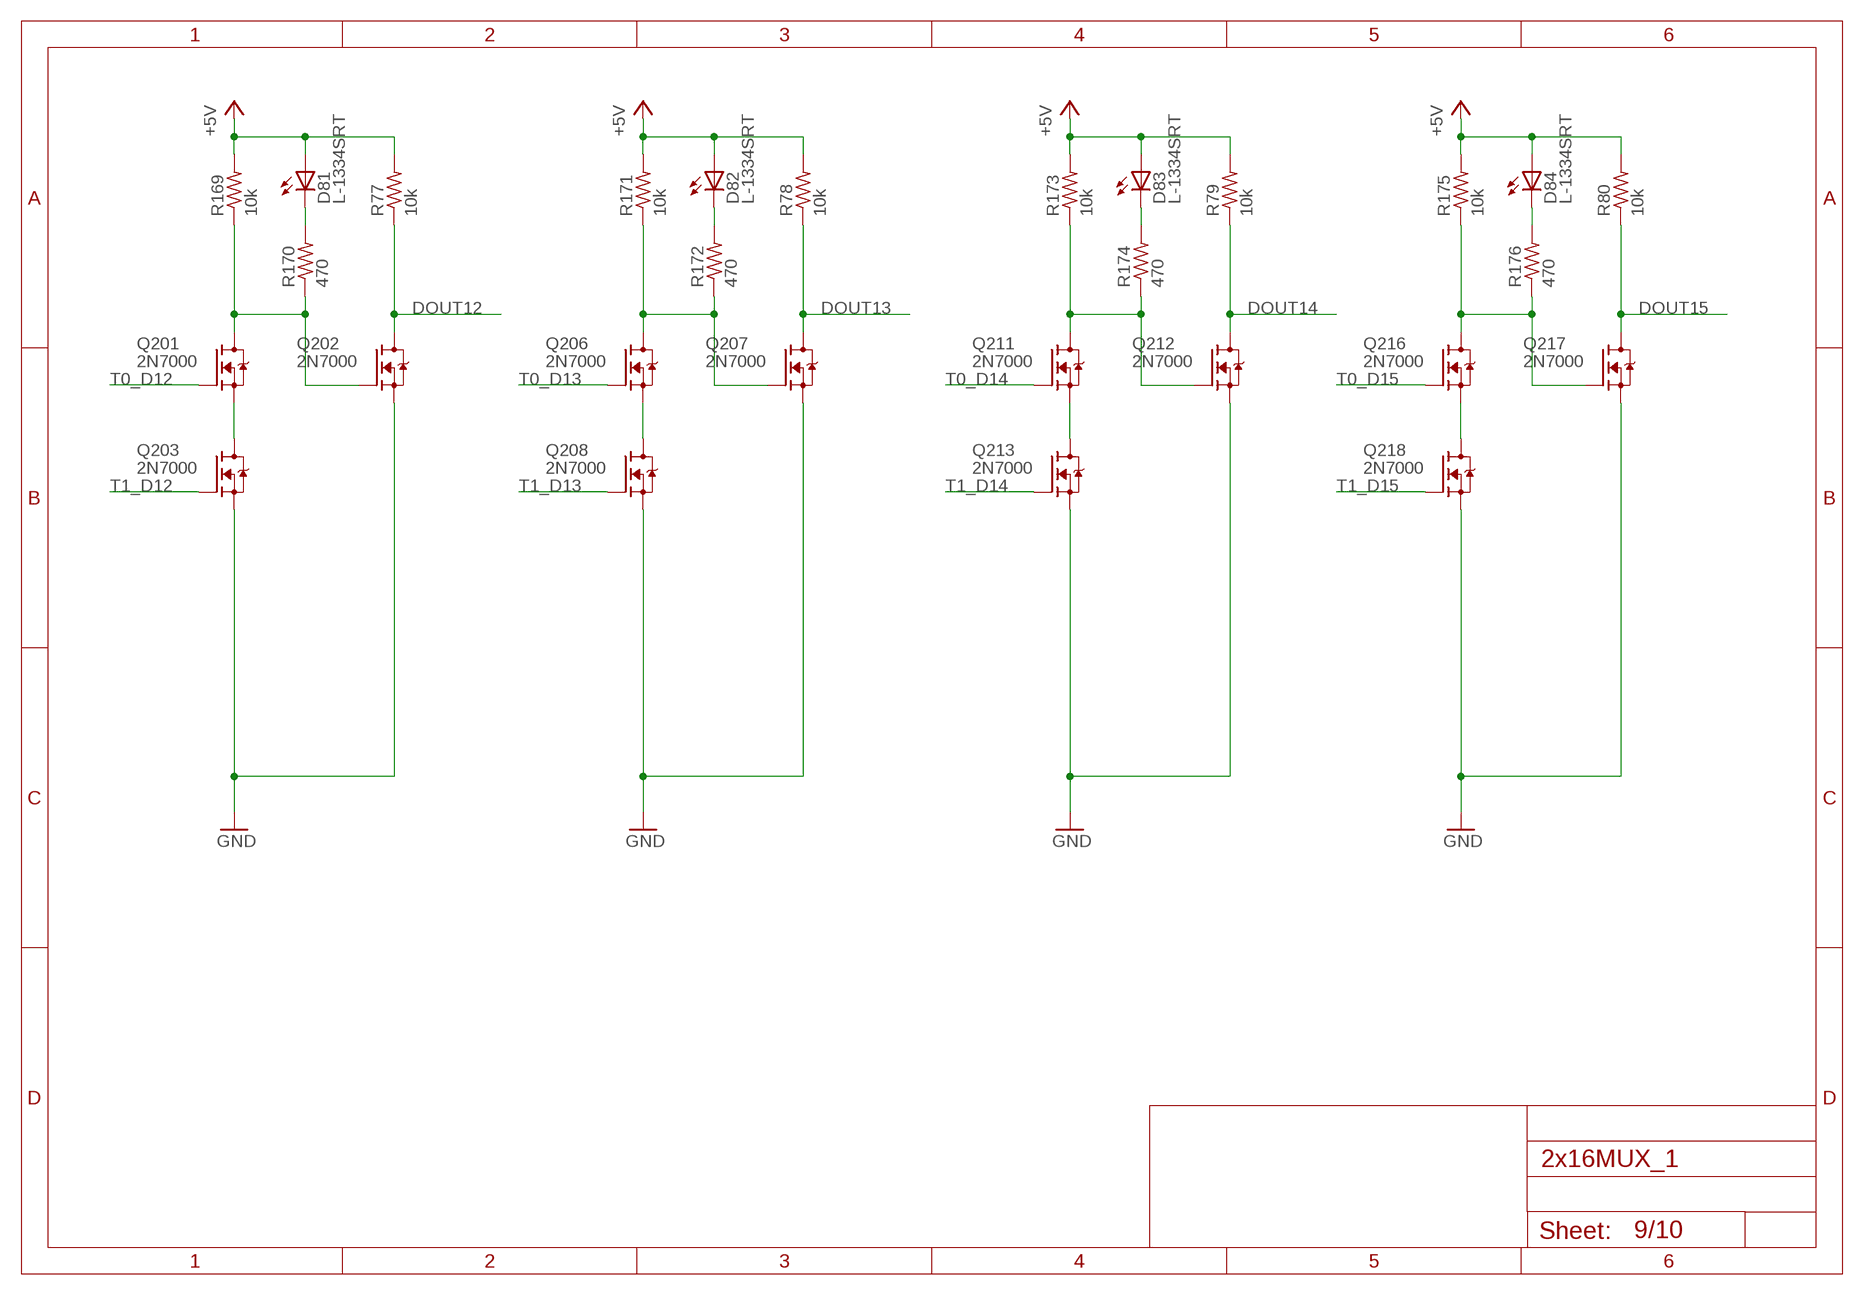
[diagram p8: schematic, sheet 9]

### Parts
D81  L-1334SRT  [LED3MM]
D82  L-1334SRT  [LED3MM]
D83  L-1334SRT  [LED3MM]
D84  L-1334SRT  [LED3MM]
Q201  2N7000  [TO92-DGS]
Q202  2N7000  [TO92-DGS]
Q203  2N7000  [TO92-DGS]
Q206  2N7000  [TO92-DGS]
Q207  2N7000  [TO92-DGS]
Q208  2N7000  [TO92-DGS]
Q211  2N7000  [TO92-DGS]
Q212  2N7000  [TO92-DGS]
Q213  2N7000  [TO92-DGS]
Q216  2N7000  [TO92-DGS]
Q217  2N7000  [TO92-DGS]
Q218  2N7000  [TO92-DGS]
R77  10k  R_P2INCH  [R_P2INCH]
R78  10k  R_P2INCH  [R_P2INCH]
R79  10k  R_P2INCH  [R_P2INCH]
R80  10k  R_P2INCH  [R_P2INCH]
R169  10k  R_P2INCH  [R_P2INCH]
R170  470  R_P2INCH  [R_P2INCH]
R171  10k  R_P2INCH  [R_P2INCH]
R172  470  R_P2INCH  [R_P2INCH]
R173  10k  R_P2INCH  [R_P2INCH]
R174  470  R_P2INCH  [R_P2INCH]
R175  10k  R_P2INCH  [R_P2INCH]
R176  470  R_P2INCH  [R_P2INCH]

### Nets
+5V: D81.A D82.A D83.A D84.A R77.2 R78.2 R79.2 R80.2 R169.2 R171.2 R173.2 R175.2 ; also sheet 1,2,3,4,5,6,7,8
DOUT12: Q202.D R77.1 ; also sheet 10
DOUT13: Q207.D R78.1 ; also sheet 10
DOUT14: Q212.D R79.1 ; also sheet 10
DOUT15: Q217.D R80.1 ; also sheet 10
GND: Q202.S Q203.S Q207.S Q208.S Q212.S Q213.S Q217.S Q218.S ; also sheet 1,2,3,4,5,6,7,8,10
N$197: Q201.D Q202.G R169.1 R170.1
N$198: D81.K(C) R170.2
N$201: Q201.S Q203.D
N$202: Q206.D Q207.G R171.1 R172.1
N$203: D82.K(C) R172.2
N$206: Q206.S Q208.D
N$207: Q211.D Q212.G R173.1 R174.1
N$208: D83.K(C) R174.2
N$211: Q211.S Q213.D
N$212: Q216.D Q217.G R175.1 R176.1
N$213: D84.K(C) R176.2
N$216: Q216.S Q218.D
T0_D12: Q201.G ; also sheet 3
T0_D13: Q206.G ; also sheet 3
T0_D14: Q211.G ; also sheet 3
T0_D15: Q216.G ; also sheet 3
T1_D12: Q203.G ; also sheet 5
T1_D13: Q208.G ; also sheet 5
T1_D14: Q213.G ; also sheet 5
T1_D15: Q218.G ; also sheet 5

## Sheet 10 of 10
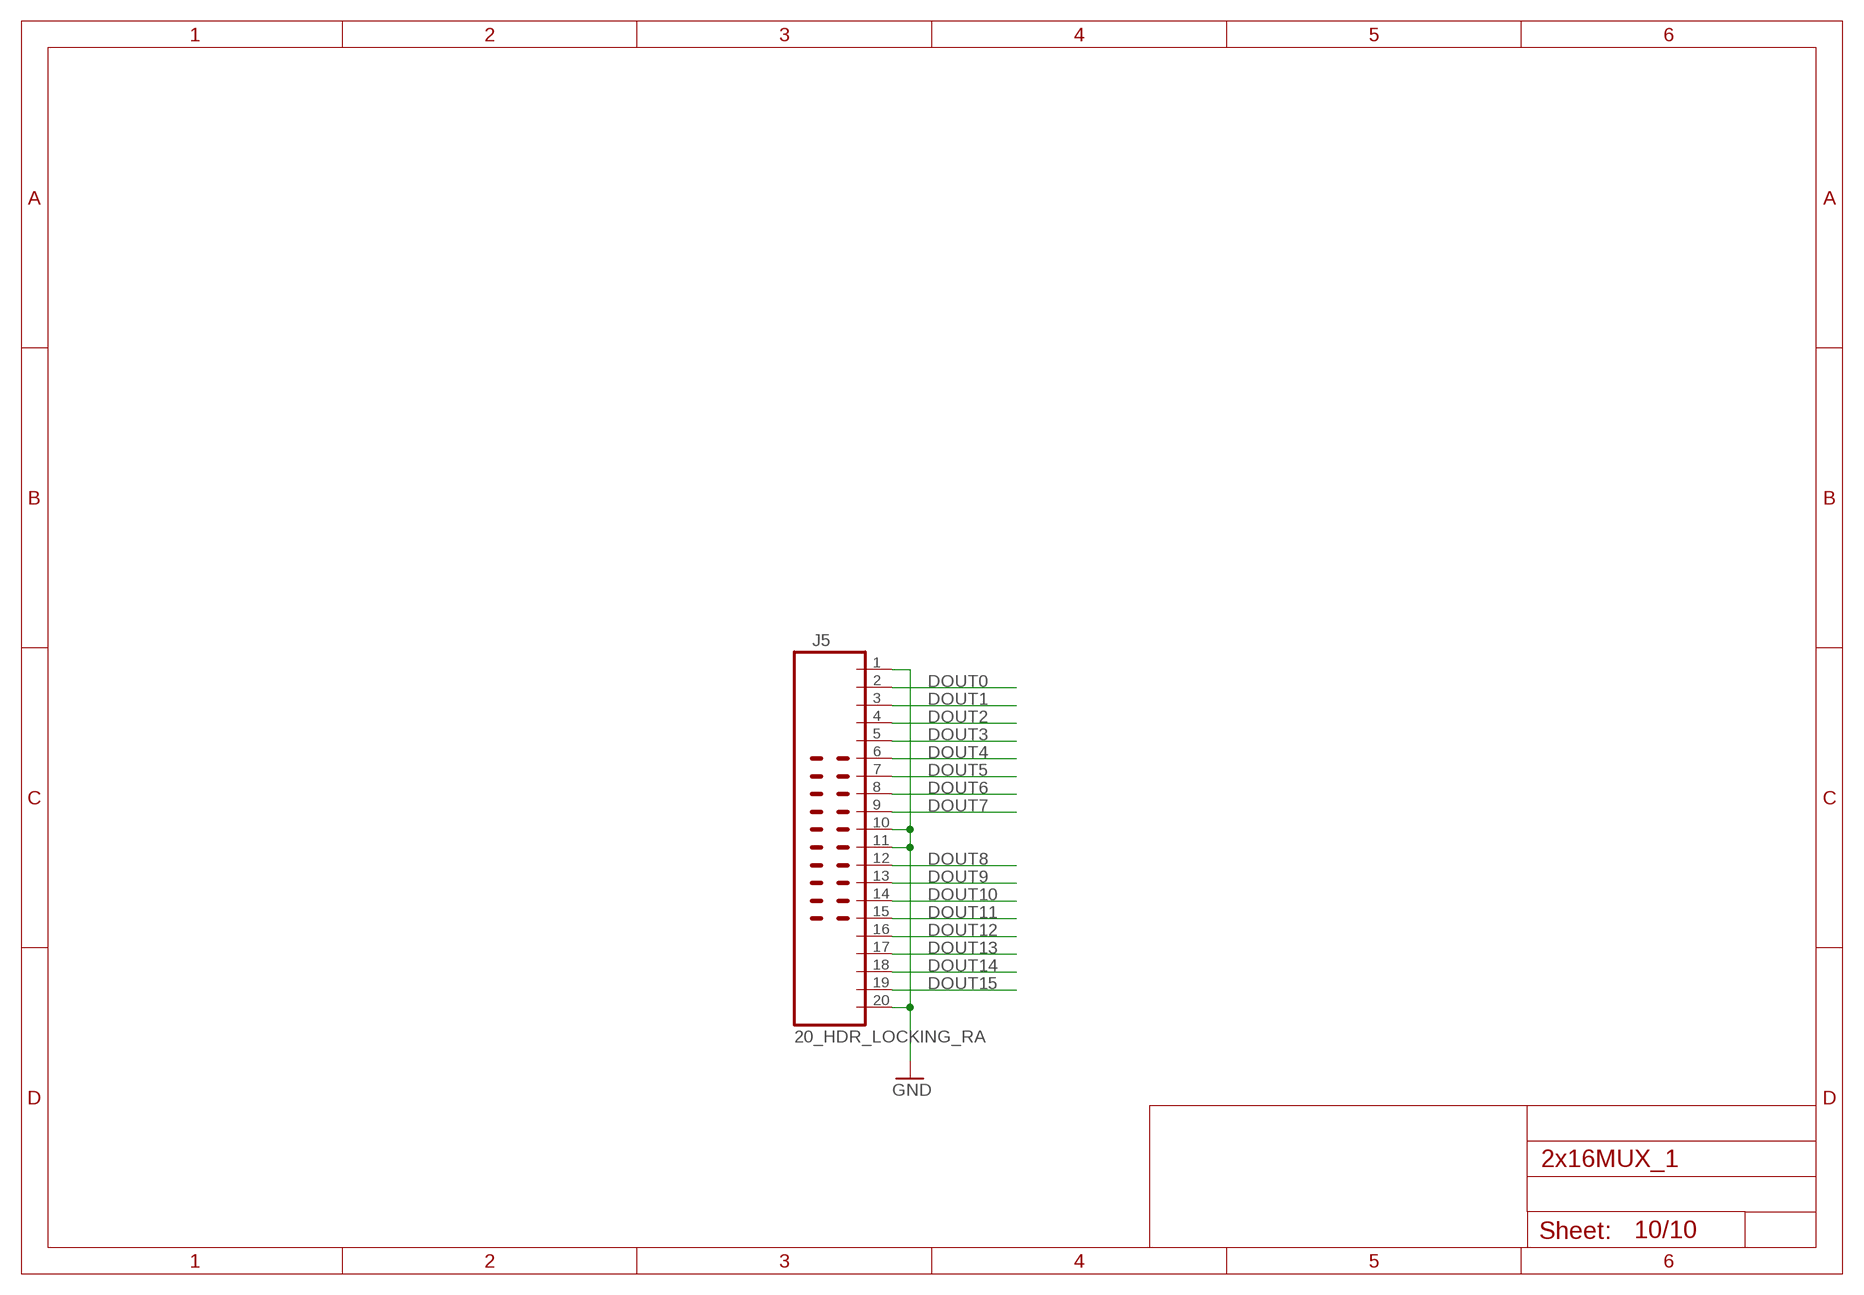
[diagram p9: schematic, sheet 10]

### Parts
J5  20_HDR_LOCKING_RA  [20_HDR_LOCKING_RA]

### Nets
DOUT0: J5.2 ; also sheet 6
DOUT1: J5.3 ; also sheet 6
DOUT2: J5.4 ; also sheet 6
DOUT3: J5.5 ; also sheet 6
DOUT4: J5.6 ; also sheet 7
DOUT5: J5.7 ; also sheet 7
DOUT6: J5.8 ; also sheet 7
DOUT7: J5.9 ; also sheet 7
DOUT8: J5.12 ; also sheet 8
DOUT9: J5.13 ; also sheet 8
DOUT10: J5.14 ; also sheet 8
DOUT11: J5.15 ; also sheet 8
DOUT12: J5.16 ; also sheet 9
DOUT13: J5.17 ; also sheet 9
DOUT14: J5.18 ; also sheet 9
DOUT15: J5.19 ; also sheet 9
GND: J5.1 J5.10 J5.11 J5.20 ; also sheet 1,2,3,4,5,6,7,8,9

## Library data of the parts
C1-C6 C8 = MyLib:C_P2INCH
C7 = MyLib:POLARISED_CAP_2P5_6P3MM
D1-D32 D65 D66 D69-D86 = MyLib:L-1334SRT
H1-H4 = MyLib:3M_MOUNT_HOLE
J1 J2 J5 = MyLib:20_HDR_LOCKING_RA
Q1-Q64 Q129-Q134 Q141-Q143 Q146-Q148 Q151-Q153 Q156-Q158 Q161-Q163 Q166-Q168 Q171-Q173 Q176-Q178 Q181-Q183 Q186-Q188 Q191-Q193 Q196-Q198 Q201-Q203 Q206-Q208 Q211-Q213 Q216-Q218 = MyLib:2N7000
R1-R80 R129-R136 R145-R178 R181-R212 = MyLib:R_P2INCH
TP1 TP2 TP5 TP6 = MyLib:TEST_LOOP